# EAGLE design Daughter Card v2 (EAGLE 6.5.0)
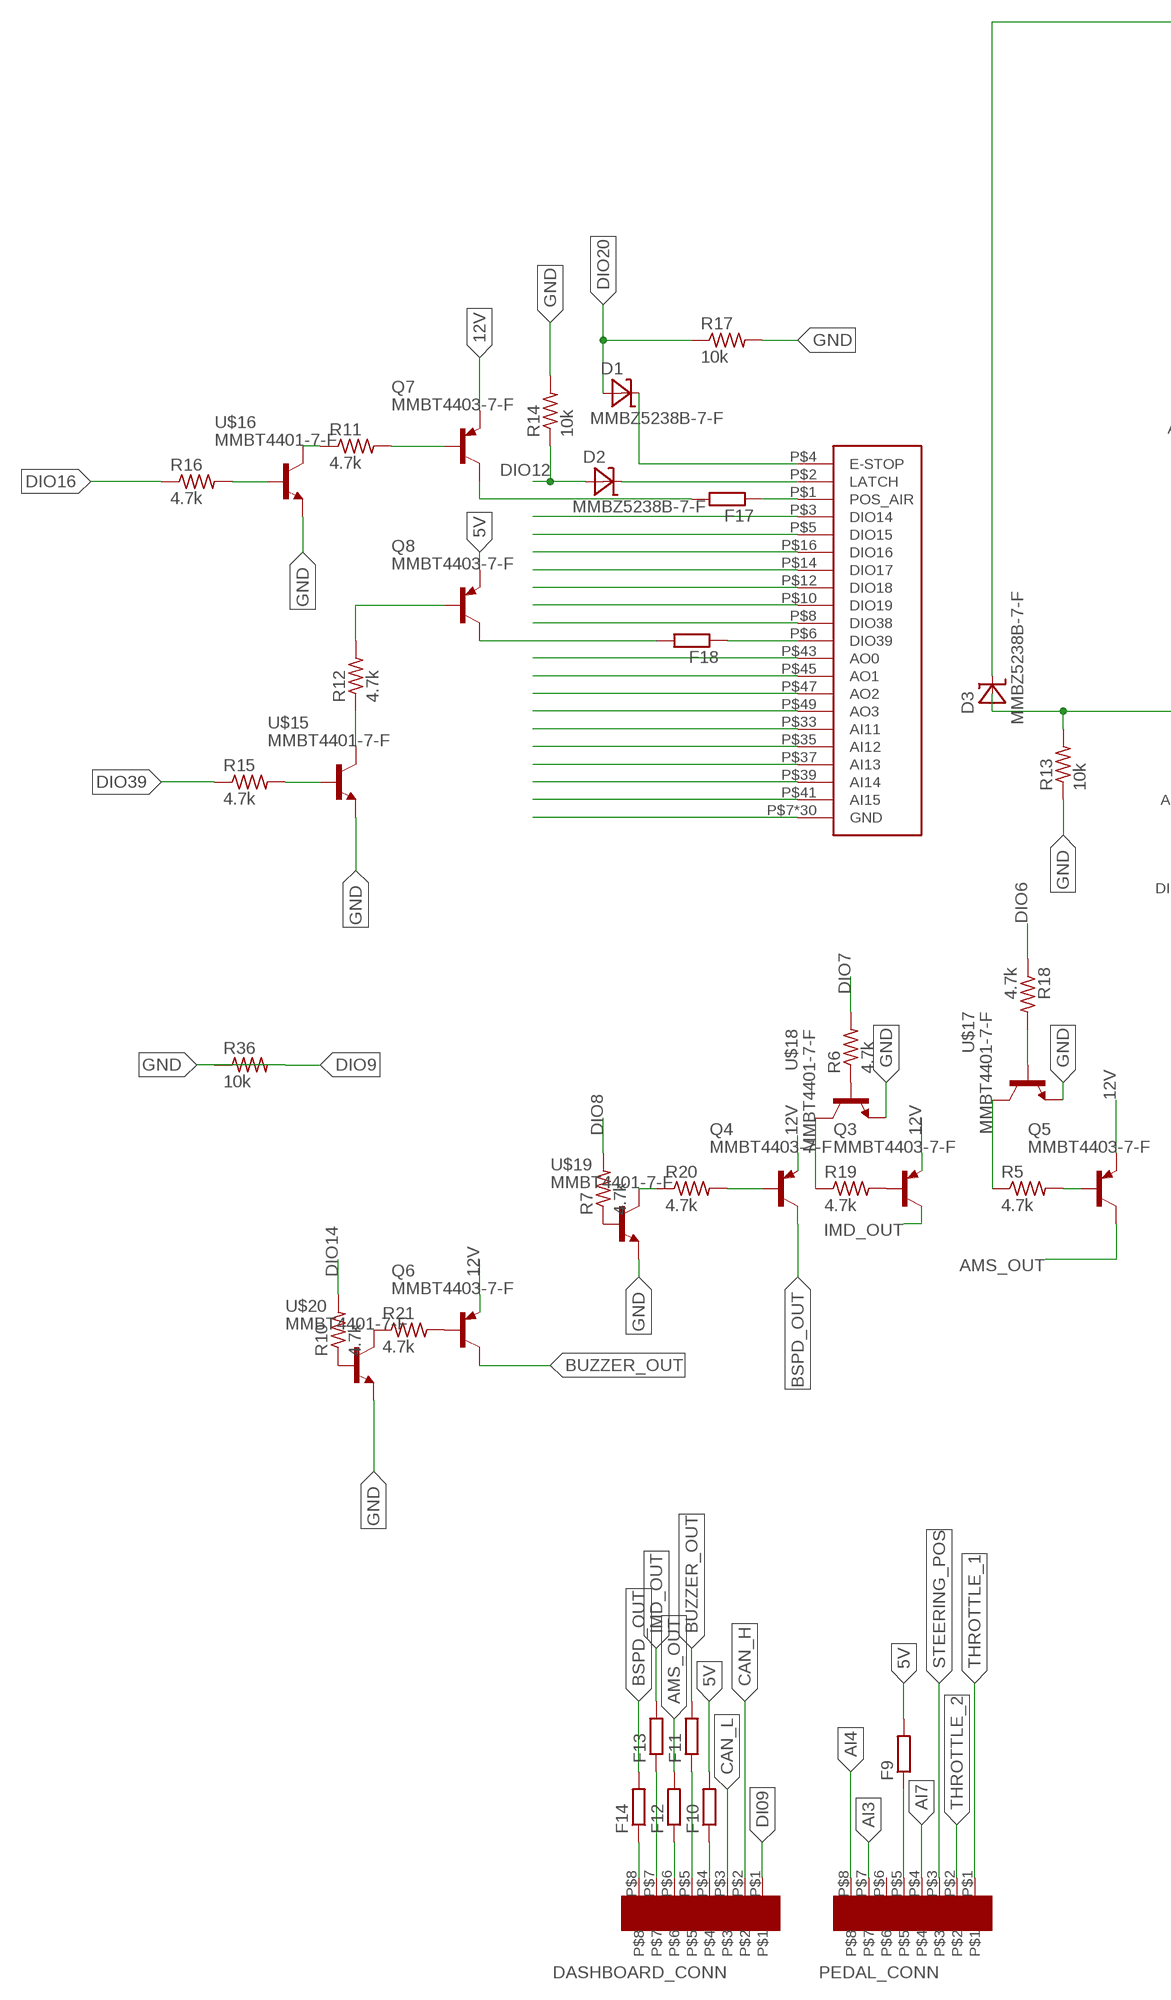
[diagram p0: schematic, sheet 1, part 1 of 2]
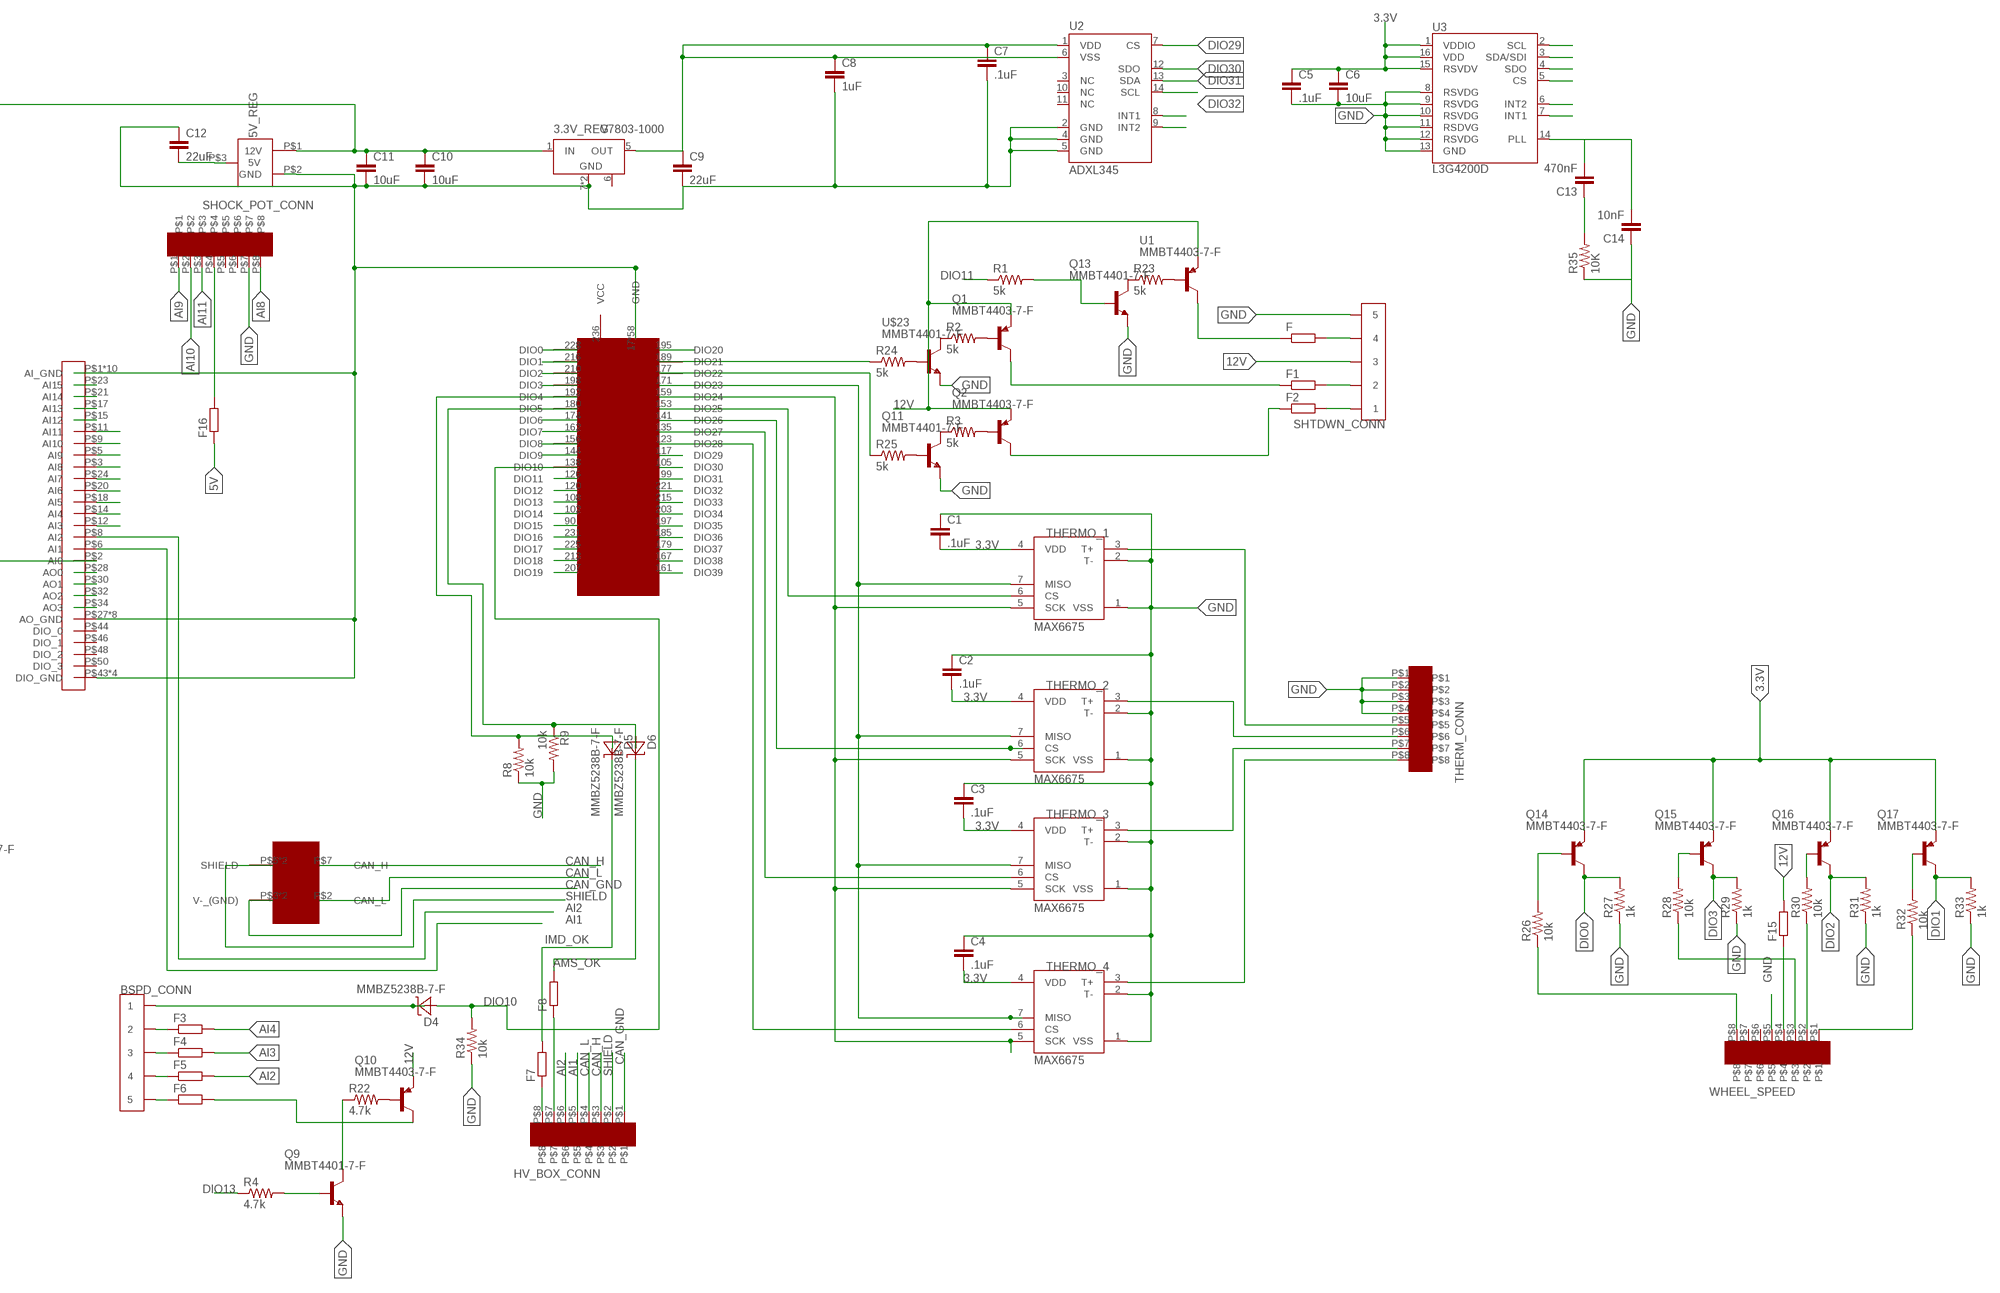
[diagram p1: schematic, sheet 1, part 2 of 2]

## Parts
3.3V_REG  V7803-1000  [V78XX-1000]
5V_REG  V78XX-1500  [V78XX-1500R]
BSPD_CONN  CONN_5  [CONNECTOR_5]
C1  .1uF  CAP0603-CAP  [0603-CAP]
C2  .1uF  CAP0603-CAP  [0603-CAP]
C3  .1uF  CAP0603-CAP  [0603-CAP]
C4  .1uF  CAP0603-CAP  [0603-CAP]
C5  .1uF  CAP0603-CAP  [0603-CAP]
C6  10uF  CAP0603-CAP  [0603-CAP]
C7  .1uF  CAP0603-CAP  [0603-CAP]
C8  1uF  CAP0603-CAP  [0603-CAP]
C9  22uF  CAP0603-CAP  [0603-CAP]
C10  10uF  CAP0603-CAP  [0603-CAP]
C11  10uF  CAP0603-CAP  [0603-CAP]
C12  22uF  CAP0603-CAP  [0603-CAP]
C13  470nF  CAP0603-CAP  [0603-CAP]
C14  10nF  CAP0603-CAP  [0603-CAP]
D1  MMBZ5238B-7-F  [SOT-23-3]
D2  MMBZ5238B-7-F  [SOT-23-3]
D3  MMBZ5238B-7-F  [SOT-23-3]
D4  MMBZ5238B-7-F  [SOT-23-3]
D5  MMBZ5238B-7-F  [SOT-23-3]
D6  MMBZ5238B-7-F  [SOT-23-3]
DASHBOARD_CONN  EN3_PCB_8  [EN3_PCB_8]
F  R-EU_R0402  [R0402]
F1  R-EU_R0402  [R0402]
F2  R-EU_R0402  [R0402]
F3  R-EU_R0402  [R0402]
F4  R-EU_R0402  [R0402]
F5  R-EU_R0402  [R0402]
F6  R-EU_R0402  [R0402]
F7  R-EU_R0402  [R0402]
F8  R-EU_R0402  [R0402]
F9  R-EU_R0402  [R0402]
F10  R-EU_R0402  [R0402]
F11  R-EU_R0402  [R0402]
F12  R-EU_R0402  [R0402]
F13  R-EU_R0402  [R0402]
F14  R-EU_R0402  [R0402]
F15  R-EU_R0402  [R0402]
F16  R-EU_R0402  [R0402]
F17  R-EU_R0402  [R0402]
F18  R-EU_R0402  [R0402]
HV_BOX_CONN  EN3_PCB_8  [EN3_PCB_8]
PEDAL_CONN  EN3_PCB_8  [EN3_PCB_8]
Q1  MMBT4403-7-F  [SOT-23-3]
Q2  MMBT4403-7-F  [SOT-23-3]
Q3  MMBT4403-7-F  [SOT-23-3]
Q4  MMBT4403-7-F  [SOT-23-3]
Q5  MMBT4403-7-F  [SOT-23-3]
Q6  MMBT4403-7-F  [SOT-23-3]
Q7  MMBT4403-7-F  [SOT-23-3]
Q8  MMBT4403-7-F  [SOT-23-3]
Q9  MMBT4401-7-F  [SOT-23-3]
Q10  MMBT4403-7-F  [SOT-23-3]
Q11  MMBT4401-7-F  [SOT-23-3]
Q13  MMBT4401-7-F  [SOT-23-3]
Q14  MMBT4403-7-F  [SOT-23-3]
Q15  MMBT4403-7-F  [SOT-23-3]
Q16  MMBT4403-7-F  [SOT-23-3]
Q17  MMBT4403-7-F  [SOT-23-3]
R1  5k  R-US_R0402  [R0402]
R2  5k  R-US_R0402  [R0402]
R3  5k  R-US_R0402  [R0402]
R4  4.7k  R-US_R0402  [R0402]
R5  4.7k  R-US_R0402  [R0402]
R6  4.7k  R-US_R0402  [R0402]
R7  4.7k  R-US_R0402  [R0402]
R8  10k  R-US_R0402  [R0402]
R9  10k  R-US_R0402  [R0402]
R10  4.7k  R-US_R0402  [R0402]
R11  4.7k  R-US_R0402  [R0402]
R12  4.7k  R-US_R0402  [R0402]
R13  10k  R-US_R0402  [R0402]
R14  10k  R-US_R0402  [R0402]
R15  4.7k  R-US_R0402  [R0402]
R16  4.7k  R-US_R0402  [R0402]
R17  10k  R-US_R0402  [R0402]
R18  4.7k  R-US_R0402  [R0402]
R19  4.7k  R-US_R0402  [R0402]
R20  4.7k  R-US_R0402  [R0402]
R21  4.7k  R-US_R0402  [R0402]
R22  4.7k  R-US_R0402  [R0402]
R23  5k  R-US_R0402  [R0402]
R24  5k  R-US_R0402  [R0402]
R25  5k  R-US_R0402  [R0402]
R26  10k  R-US_R0402  [R0402]
R27  1k  R-US_R0402  [R0402]
R28  10k  R-US_R0402  [R0402]
R29  1k  R-US_R0402  [R0402]
R30  10k  R-US_R0402  [R0402]
R31  1k  R-US_R0402  [R0402]
R32  10k  R-US_R0402  [R0402]
R33  1k  R-US_R0402  [R0402]
R34  10k  R-US_R0402  [R0402]
R35  10K  RESISTOR0603-RES  [0603-RES]
R36  10k  R-US_R0402  [R0402]
SBRIO_ANALOG  SBRIO_MIO  [SBRIO_J502_J503]
SBRIO_AUX  SBRIO_AUX  [SBRIO_J502_J503]
SHOCK_POT_CONN  EN3_PCB_8  [EN3_PCB_8]
SHTDWN_CONN  CONN_5  [CONNECTOR_5]
THERM_CONN  EN3_PCB_8  [EN3_PCB_8]
THERMO_1  MAX6675  [SO08]
THERMO_2  MAX6675  [SO08]
THERMO_3  MAX6675  [SO08]
THERMO_4  MAX6675  [SO08]
U1  MMBT4403-7-F  [SOT-23-3]
U2  ADXL345  [LGA14]
U3  L3G4200D  [LGA16-4X4]
U$2  SBRIO_W500  [SBRIO_W]
U$3  SBRIO_RMC  [SEAM-40-XX.X-XX-06-X-A]
U$15  MMBT4401-7-F  [SOT-23-3]
U$16  MMBT4401-7-F  [SOT-23-3]
U$17  MMBT4401-7-F  [SOT-23-3]
U$18  MMBT4401-7-F  [SOT-23-3]
U$19  MMBT4401-7-F  [SOT-23-3]
U$20  MMBT4401-7-F  [SOT-23-3]
U$23  MMBT4401-7-F  [SOT-23-3]
WHEEL_SPEED  EN3_PCB_8  [EN3_PCB_8]

## Nets
3.3V: 3.3V_REG.5(OUT) C1.2 C2.2 C3.2 C4.2 C5.1 C6.1 C7.1 C8.1 C9.1 Q14.P$3(E) Q15.P$3(E) Q16.P$3(E) Q17.P$3(E) THERMO_1.4(VDD) THERMO_2.4(VDD) THERMO_3.4(VDD) THERMO_4.4(VDD) U2.1(VDD) U2.6(VSS) U3.1(VDDIO) U3.15(RSVDV) U3.16(VDD)
5V: 5V_REG.P$3(5V) C12.2 F9.2 F10.2 F16.1 Q8.P$3(E)
12V: 3.3V_REG.1(IN) 5V_REG.P$1(12V) C10.1 C11.1 D3.P$1(C) F15.2 Q1.P$3(E) Q2.P$3(E) Q3.P$3(E) Q4.P$3(E) Q5.P$3(E) Q6.P$3(E) Q7.P$3(E) Q10.P$3(E) SHTDWN_CONN.5 SHTDWN_CONN.6 U1.P$3(E)
AI1: HV_BOX_CONN.P$5 SBRIO_ANALOG.P$6(AI1)
AI2: F5.2 HV_BOX_CONN.P$6 SBRIO_ANALOG.P$8(AI2)
AI3: F4.2 PEDAL_CONN.P$7 SBRIO_ANALOG.P$12(AI3)
AI4: F3.2 PEDAL_CONN.P$8 SBRIO_ANALOG.P$14(AI4)
AI7: PEDAL_CONN.P$4 SBRIO_ANALOG.P$24(AI7)
AI8: SBRIO_ANALOG.P$3(AI8) SHOCK_POT_CONN.P$8
AI9: SBRIO_ANALOG.P$5(AI9) SHOCK_POT_CONN.P$1
AI10: SBRIO_ANALOG.P$9(AI10) SHOCK_POT_CONN.P$2
AI11: SBRIO_ANALOG.P$11(AI11) SBRIO_AUX.P$33(AI11) SHOCK_POT_CONN.P$3
AI12: SBRIO_ANALOG.P$15(AI12) SBRIO_AUX.P$35(AI12)
AI13: SBRIO_ANALOG.P$17(AI13) SBRIO_AUX.P$37(AI13)
AI15: SBRIO_ANALOG.P$23(AI15) SBRIO_AUX.P$41(AI15)
AMS_OK: D6.P$1(C) F8.2
AMS_OUT: F12.2 Q5.P$1(C)
AO0: SBRIO_ANALOG.P$28(AO0) SBRIO_AUX.P$43(AO0)
AO1: SBRIO_ANALOG.P$30(AO1) SBRIO_AUX.P$45(AO1)
AO2: SBRIO_ANALOG.P$32(AO2) SBRIO_AUX.P$47(AO2)
AO3: SBRIO_ANALOG.P$34(AO3) SBRIO_AUX.P$49(AO3)
BSPD_OUT: F14.2 Q4.P$1(C)
BUZZER_OUT: F11.2 Q6.P$1(C)
CAN_GND: HV_BOX_CONN.P$1 U$2.P$3(V-_(GND)) U$2.P$6(V-_(GND))
CAN_H: DASHBOARD_CONN.P$2 HV_BOX_CONN.P$3 U$2.P$7(CAN_H)
CAN_L: DASHBOARD_CONN.P$3 HV_BOX_CONN.P$4 U$2.P$2(CAN_L)
DI09: DASHBOARD_CONN.P$1
DIO0: Q14.P$1(C) R27.2 U$3.228(DIO0)
DIO1: Q17.P$1(C) R33.2 U$3.216(DIO1)
DIO2: Q16.P$1(C) R31.2 U$3.210(DIO2)
DIO3: Q15.P$1(C) R29.2 U$3.198(DIO3)
DIO6: R18.1 U$3.174(DIO6)
DIO7: R6.2 U$3.162(DIO7)
DIO8: R7.2 U$3.156(DIO8)
DIO9: R36.2 U$3.144(DIO9)
DIO10: D4.P$2(A) R34.2 U$3.138(DIO10)
DIO11: R1.1 U$3.126(DIO11)
DIO12: D2.P$2(A) R14.1 U$3.120(DIO12)
DIO13: R4.1 U$3.108(DIO13)
DIO14: R10.2 SBRIO_AUX.P$3(DIO14) U$3.102(DIO14)
DIO15: SBRIO_AUX.P$5(DIO15) U$3.90(DIO15)
DIO16: R16.1 SBRIO_AUX.P$16(DIO16) U$3.231(DIO16)
DIO17: SBRIO_AUX.P$14(DIO17) U$3.225(DIO17)
DIO18: SBRIO_AUX.P$12(DIO18) U$3.213(DIO18)
DIO19: SBRIO_AUX.P$10(DIO19) U$3.207(DIO19)
DIO20: D1.P$2(A) R17.1 U$3.195(DIO20)
DIO29: U2.7(CS) U$3.117(DIO29)
DIO30: U2.12(SDO) U3.4(SDO) U$3.105(DIO30)
DIO31: U2.13(SDA) U3.3(SDA/SDI) U$3.99(DIO31)
DIO32: U2.14(SCL) U3.2(SCL) U$3.221(DIO32)
DIO33: U3.5(CS) U$3.215(DIO33)
DIO34: U3.7(INT1) U$3.203(DIO34)
DIO35: U3.6(INT2) U$3.197(DIO35)
DIO36: U2.8(INT1) U$3.185(DIO36)
DIO37: U2.9(INT2) U$3.179(DIO37)
DIO38: SBRIO_AUX.P$8(DIO38) U$3.167(DIO38)
DIO39: R15.1 U$3.161(DIO39)
GND: 3.3V_REG.7(GND) 3.3V_REG.9(GND) 5V_REG.P$2(GND) C1.1 C2.1 C3.1 C4.1 C5.2 C6.2 C7.2 C8.2 C9.2 C10.2 C11.2 C12.1 C14.1 Q9.P$3(E) Q11.P$3(E) Q13.P$3(E) R8.1 R9.2 R13.1 R14.2 R17.2 R27.1 R29.1 R31.1 R33.1 R34.1 R35.1 R36.1 SBRIO_ANALOG.P$1(AI_GND) SBRIO_ANALOG.P$4(AI_GND) SBRIO_ANALOG.P$7(AI_GND) SBRIO_ANALOG.P$10(AI_GND) SBRIO_ANALOG.P$13(AI_GND) SBRIO_ANALOG.P$16(AI_GND) SBRIO_ANALOG.P$19(AI_GND) SBRIO_ANALOG.P$22(AI_GND) SBRIO_ANALOG.P$25(AI_GND) SBRIO_ANALOG.P$26(AI_GND) SBRIO_ANALOG.P$27(AO_GND) SBRIO_ANALOG.P$29(AO_GND) SBRIO_ANALOG.P$31(AO_GND) SBRIO_ANALOG.P$33(AO_GND) SBRIO_ANALOG.P$35(AO_GND) SBRIO_ANALOG.P$37(AO_GND) SBRIO_ANALOG.P$39(AO_GND) SBRIO_ANALOG.P$41(AO_GND) SBRIO_ANALOG.P$43(DIO_GND) SBRIO_ANALOG.P$45(DIO_GND) SBRIO_ANALOG.P$47(DIO_GND) SBRIO_ANALOG.P$49(DIO_GND) SBRIO_AUX.P$7(GND) SBRIO_AUX.P$9(GND) SBRIO_AUX.P$11(GND) SBRIO_AUX.P$13(GND) SBRIO_AUX.P$15(GND) SBRIO_AUX.P$17(GND) SBRIO_AUX.P$18(GND) SBRIO_AUX.P$19(GND) SBRIO_AUX.P$20(GND) SBRIO_AUX.P$21(GND) SBRIO_AUX.P$22(GND) SBRIO_AUX.P$23(GND) SBRIO_AUX.P$24(GND) SBRIO_AUX.P$25(GND) SBRIO_AUX.P$26(GND) SBRIO_AUX.P$27(GND) SBRIO_AUX.P$28(GND) SBRIO_AUX.P$29(GND) SBRIO_AUX.P$30(GND) SBRIO_AUX.P$31(GND) SBRIO_AUX.P$32(GND) SBRIO_AUX.P$34(GND) SBRIO_AUX.P$36(GND) SBRIO_AUX.P$38(GND) SBRIO_AUX.P$40(GND) SBRIO_AUX.P$42(GND) SBRIO_AUX.P$44(GND) SBRIO_AUX.P$46(GND) SBRIO_AUX.P$48(GND) SBRIO_AUX.P$50(GND) SHOCK_POT_CONN.P$7 SHTDWN_CONN.9 SHTDWN_CONN.10 THERM_CONN.P$1 THERM_CONN.P$2 THERM_CONN.P$3 THERM_CONN.P$4 THERMO_1.1(VSS) THERMO_1.2(T-) THERMO_2.1(VSS) THERMO_2.2(T-) THERMO_3.1(VSS) THERMO_3.2(T-) THERMO_4.1(VSS) THERMO_4.2(T-) U2.2(GND) U2.4(GND) U2.5(GND) U3.8(RSVDG) U3.9(RSVDG) U3.10(RSVDG) U3.11(RSDVG) U3.12(RSVDG) U3.13(GND) U$3.17(GND) U$3.23(GND) U$3.30(GND) U$3.36(GND) U$3.41(GND) U$3.47(GND) U$3.78(GND) U$3.83(GND) U$3.88(GND) U$3.93(GND) U$3.96(GND) U$3.98(GND) U$3.101(GND) U$3.103(GND) U$3.106(GND) U$3.111(GND) U$3.114(GND) U$3.116(GND) U$3.119(GND) U$3.121(GND) U$3.124(GND) U$3.129(GND) U$3.132(GND) U$3.134(GND) U$3.137(GND) U$3.139(GND) U$3.142(GND) U$3.147(GND) U$3.150(GND) U$3.152(GND) U$3.155(GND) U$3.157(GND) U$3.160(GND) U$3.165(GND) U$3.168(GND) U$3.170(GND) U$3.173(GND) U$3.175(GND) U$3.178(GND) U$3.183(GND) U$3.186(GND) U$3.188(GND) U$3.191(GND) U$3.193(GND) U$3.196(GND) U$3.201(GND) U$3.204(GND) U$3.206(GND) U$3.209(GND) U$3.211(GND) U$3.214(GND) U$3.219(GND) U$3.222(GND) U$3.224(GND) U$3.227(GND) U$3.229(GND) U$3.232(GND) U$3.237(GND) U$15.P$3(E) U$16.P$3(E) U$17.P$3(E) U$18.P$3(E) U$19.P$3(E) U$20.P$3(E) U$23.P$3(E) WHEEL_SPEED.P$5
IMD_OK: D5.P$1(C) F7.2
IMD_OUT: F13.2 Q3.P$1(C)
N$1: D2.P$1(C) SBRIO_AUX.P$2(LATCH)
N$2: D1.P$1(C) SBRIO_AUX.P$4(E-STOP)
N$3: R32.1 WHEEL_SPEED.P$1
N$4: D3.P$2(A) R13.2 SBRIO_ANALOG.P$2(AI0)
N$5: Q6.P$2(B) R21.2
N$6: Q16.P$2(B) R30.2
N$7: F1.1 Q1.P$1(C)
N$8: F2.1 Q2.P$1(C)
N$9: R28.1 WHEEL_SPEED.P$3
N$10: R26.1 WHEEL_SPEED.P$8
N$11: R24.1 U$3.189(DIO21)
N$12: R25.1 U$3.177(DIO22)
N$13: F8.1 HV_BOX_CONN.P$7
N$14: F7.1 HV_BOX_CONN.P$8
N$15: D5.P$2(A) R8.2 U$3.192(DIO4)
N$16: D6.P$2(A) R9.1 U$3.180(DIO5)
N$17: THERMO_1.7(MISO) THERMO_2.7(MISO) THERMO_3.7(MISO) THERMO_4.7(MISO) U$3.171(DIO23)
N$18: THERMO_1.5(SCK) THERMO_2.5(SCK) THERMO_3.5(SCK) THERMO_4.5(SCK) U$3.159(DIO24)
N$20: F16.2 SHOCK_POT_CONN.P$4
N$21: F15.1 WHEEL_SPEED.P$4
N$22: F9.1 PEDAL_CONN.P$5
N$23: DASHBOARD_CONN.P$4 F10.1
N$24: DASHBOARD_CONN.P$5 F11.1
N$25: THERMO_1.6(CS) U$3.153(DIO25)
N$26: THERMO_2.6(CS) U$3.141(DIO26)
N$27: THERMO_3.6(CS) U$3.135(DIO27)
N$28: THERMO_4.6(CS) U$3.123(DIO28)
N$29: THERM_CONN.P$5 THERMO_1.3(T+)
N$30: THERM_CONN.P$6 THERMO_2.3(T+)
N$31: THERM_CONN.P$7 THERMO_3.3(T+)
N$32: THERM_CONN.P$8 THERMO_4.3(T+)
N$33: DASHBOARD_CONN.P$6 F12.1
N$34: DASHBOARD_CONN.P$7 F13.1
N$35: DASHBOARD_CONN.P$8 F14.1
N$36: F.2 SHTDWN_CONN.7 SHTDWN_CONN.8
N$37: C13.2 C14.2 U3.14(PLL)
N$38: C13.1 R35.2
N$39: F1.2 SHTDWN_CONN.3 SHTDWN_CONN.4
N$40: F2.2 SHTDWN_CONN.1 SHTDWN_CONN.2
N$41: BSPD_CONN.9 BSPD_CONN.10 F6.1
N$42: BSPD_CONN.1 BSPD_CONN.2 D4.P$1(C)
N$43: BSPD_CONN.7 BSPD_CONN.8 F5.1
N$44: F.1 U1.P$1(C)
N$45: F6.2 Q10.P$1(C)
N$46: R23.2 U1.P$2(B)
N$47: Q1.P$2(B) R2.2
N$48: Q2.P$2(B) R3.2
N$49: Q10.P$2(B) R22.2
N$50: Q5.P$2(B) R5.2
N$51: Q3.P$2(B) R19.2
N$52: BSPD_CONN.5 BSPD_CONN.6 F4.1
N$53: BSPD_CONN.3 BSPD_CONN.4 F3.1
N$54: Q7.P$2(B) R11.2
N$55: F17.1 SBRIO_AUX.P$1(POS_AIR)
N$56: F17.2 Q7.P$1(C)
N$57: F18.2 Q8.P$1(C)
N$58: Q8.P$2(B) R12.2
N$59: F18.1 SBRIO_AUX.P$6(DIO39)
N$60: R15.2 U$15.P$2(B)
N$61: R12.1 U$15.P$1(C)
N$62: R16.2 U$16.P$2(B)
N$63: R11.1 U$16.P$1(C)
N$64: R5.1 U$17.P$1(C)
N$65: R18.2 U$17.P$2(B)
N$66: R19.1 U$18.P$1(C)
N$67: R6.1 U$18.P$2(B)
N$68: Q4.P$2(B) R20.2
N$69: R20.1 U$19.P$1(C)
N$70: R7.1 U$19.P$2(B)
N$71: R21.1 U$20.P$1(C)
N$72: R10.1 U$20.P$2(B)
N$73: Q9.P$1(C) R22.1
N$74: Q9.P$2(B) R4.2
N$75: Q13.P$1(C) R23.1
N$76: Q13.P$2(B) R1.2
N$77: R2.1 U$23.P$1(C)
N$78: Q11.P$1(C) R3.1
N$79: R24.2 U$23.P$2(B)
N$80: Q11.P$2(B) R25.2
N$81: Q14.P$2(B) R26.2
N$82: Q15.P$2(B) R28.2
N$83: R30.1 WHEEL_SPEED.P$2
N$84: Q17.P$2(B) R32.2
SHIELD: HV_BOX_CONN.P$2 U$2.P$5(SHIELD) U$2.P$10(SHIELD)
STEERING_POS: PEDAL_CONN.P$3 SBRIO_ANALOG.P$21(AI14) SBRIO_AUX.P$39(AI14)
THROTTLE_1: PEDAL_CONN.P$1 SBRIO_ANALOG.P$18(AI5)
THROTTLE_2: PEDAL_CONN.P$2 SBRIO_ANALOG.P$20(AI6)
Unconnected: 3.3V_REG.6 PEDAL_CONN.P$6 SBRIO_ANALOG.P$44(DIO_0) SBRIO_ANALOG.P$46(DIO_1) SBRIO_ANALOG.P$48(DIO_2) SBRIO_ANALOG.P$50(DIO_3) SHOCK_POT_CONN.P$5 SHOCK_POT_CONN.P$6 U2.3(NC) U2.10(NC) U2.11(NC) WHEEL_SPEED.P$6 WHEEL_SPEED.P$7

## Power pins joined to a net without a drawn wire
VCC: U$3.236(VCC)

## Library data of the parts
3.3V_REG = formula electric:V7803-1000
5V_REG = formula electric:V78XX-1500
BSPD_CONN SHTDWN_CONN = formula electric:CONN_5
C1-C14 = SparkFun-Passives:CAP: Capacitor Standard 0603 ceramic capacitor, and 0.1" leaded capacitor.
D1-D6 = formula electric:MMBZ5238B-7-F: Digikey: MMBZ5238B-FDICT-ND
DASHBOARD_CONN HV_BOX_CONN PEDAL_CONN SHOCK_POT_CONN THERM_CONN WHEEL_SPEED = formula electric:EN3_PCB_8
F F1-F18 = resistor:R-EU_: RESISTOR, European symbol
Q1-Q8 Q10 Q14-Q17 U1 = formula electric:MMBT4403-7-F
Q9 Q11 Q13 U$15-U$20 U$23 = formula electric:MMBT4401-7-F
R1-R34 R36 = resistor:R-US_: RESISTOR, American symbol
R35 = SparkFun-Passives:RESISTOR: Resistor Basic schematic elements and footprints for 0603, 1206, and PTH resistors.
SBRIO_ANALOG = formula electric:SBRIO_MIO
SBRIO_AUX = formula electric:SBRIO_AUX: An output for a lot of the extra pins on the sbRIO.
THERMO_1-THERMO_4 = max6675:MAX6675
U2 = SparkFun-Sensors:ADXL345: 3-axis SPI/I2C 2/4/8/16g accelerometer
U3 = SparkFun-Sensors:L3G4200D: L3G4200D Three-axis, digital output gyroscope The L3G4200D is a low-power three-axis angular rate sensor, has a full scale of ±250/±500/±2000 dps and is capable of measuring rates with a user-selectable bandwidth. It includes a sensing element and an IC interface capable of providing the measured angular rate to the external world through a digital interface (I2C/SPI). Package: 4x4x1.1 LGA-16 (LGA16-4x4.PAC)
U$2 = formula electric:SBRIO_W500
U$3 = SEAM-40-XX.X-XX-06-X-A:SBRIO_RMC

## Net classes
0 default: clearance 0.205 mm

## Board
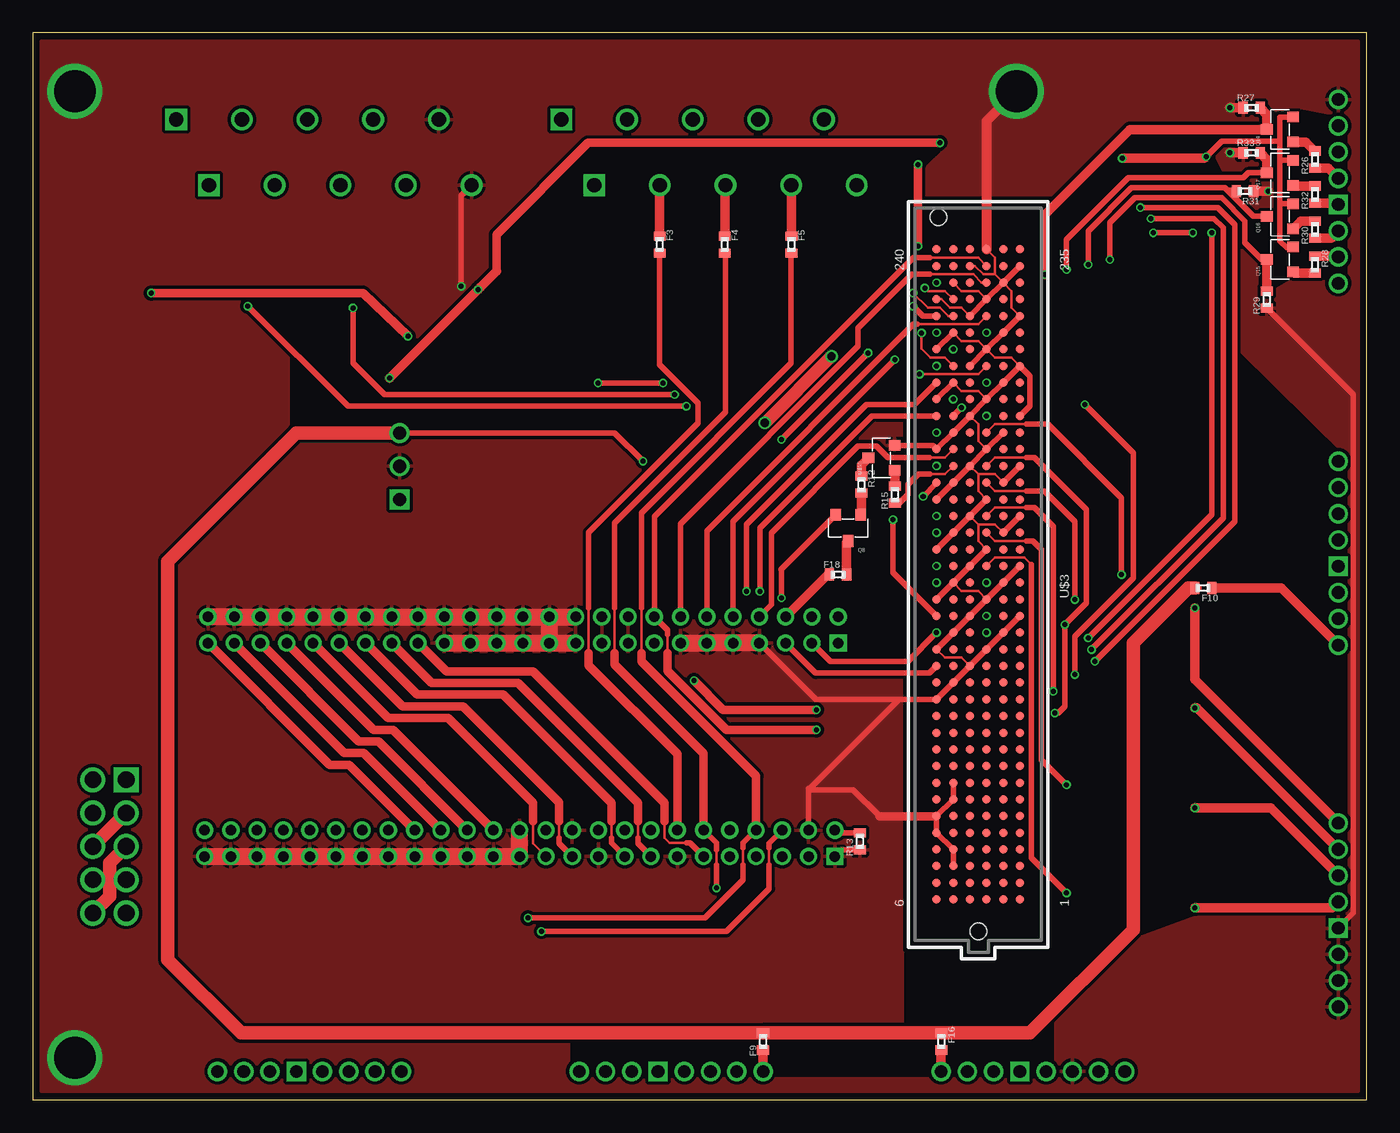
[diagram p2: board, top side]
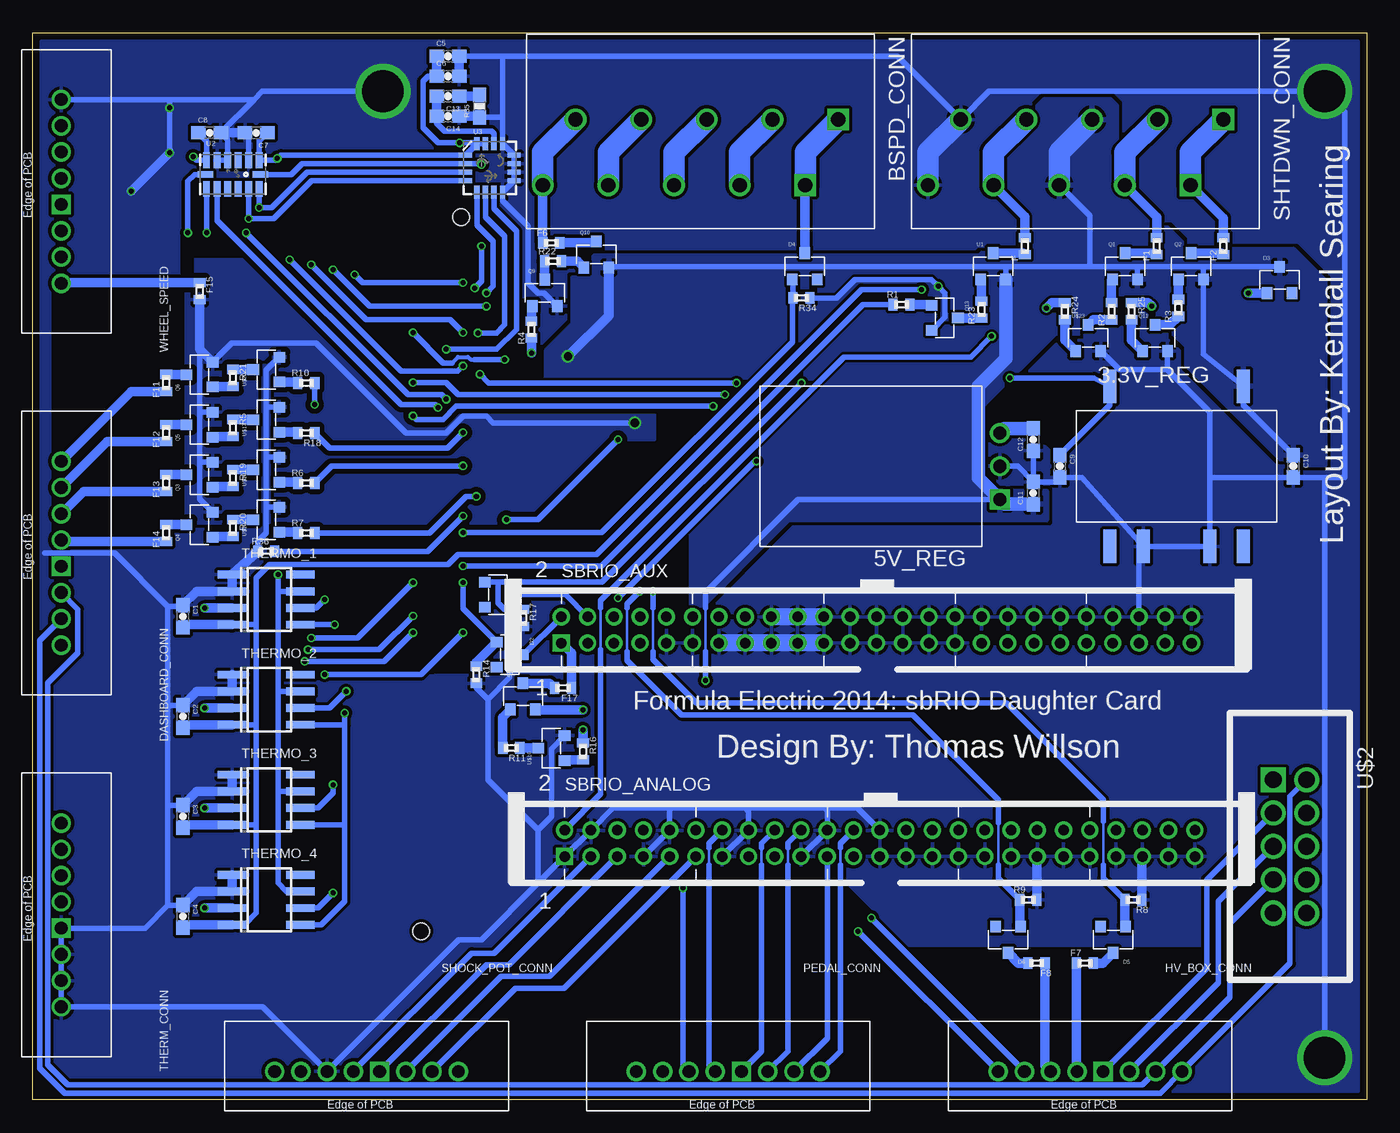
[diagram p3: board, bottom side, seen from below]

Size 101.6 x 81.28 mm. Coordinates in mm from the lower left corner, seen from the top.
Outline: 0,0 101.6,0 101.6,81.28 0,81.28 0,0
Copper layers (1*16): Top 0.035mm / dielectric 1.5mm / Bottom 0.035mm
Design rules "PCBFabExpress DRC *": minimum track width 6mil, minimum drill 15mil, track to track 6mil, track to pad 8mil, pad to pad 8mil, via to via 8mil, smd to smd 8mil, copper to edge 10mil, drill to drill 8mil, minimum pad ring 10mil, minimum via ring 5mil, stop-mask expansion 2mil, vias tented up to drill 15mil, thermal gap 10mil
tRestrict: area 66.5,11.4 to 77.5,68.6; area 46.7,33.9 to 48,35.9; area 51.9,19.6 to 54.2,21.3; area 54.5,17 to 55.8,19.4; area 46.5,19.6 to 47.8,21.2; 17 lines
bRestrict: area 54.7,34.2 to 55.9,35.6; 9 lines

### Footprints (pad centres in the part's own frame; a part is rotated, then mirrored left to right if it is on the bottom)
V78XX-1000 = smd 1 x 2.54: 1 -5.08,-6.096; 5 5.08,-6.096; 6 5.08,6.096; 7 2.54,6.096; 9 -2.54,6.096; 10 -5.08,6.096
V78XX-1500R = drill 1 square: P$1 0,2.54 | drill 1: P$2 0,0; P$3 0,-2.54
CONNECTOR_5 = drill 1.1 square: 1 0,0; 2 2.5,5 | drill 1.1: 3 5,0; 4 7.5,5; 5 10,0; 6 12.5,5; 7 15,0; 8 17.5,5; 9 20,0; 10 22.5,5
0603-CAP = smd 1.1 x 1: 1 -0.85,0; 2 0.85,0
SOT-23-3 = smd 0.8 x 0.9: P$1 0,1; P$2 -0.95,-1; P$3 0.95,-1
EN3_PCB_8 = drill 0.965 pad 1.397 square: P$1 0,0 | drill 0.965 pad 1.397: P$2 2,0; P$3 4,0; P$4 6,0; P$5 -8,0; P$6 -6,0; P$7 -4,0; P$8 -2,0
R0402 = smd 0.7 x 0.9: 1 -0.65,0; 2 0.65,0
0603-RES = smd 1.1 x 1: 1 -0.85,0; 2 0.85,0
SBRIO_J502_J503 = drill 0.8 square: P$1 0,0 | drill 0.8: P$2 0,2; P$3 2,0; P$4 2,2; P$5 4,0; P$6 4,2; P$7 6,0; P$8 6,2; P$9 8,0; P$10 8,2; P$11 10,0; P$12 10,2; P$13 12,0; P$14 12,2; P$15 14,0; P$16 14,2; P$17 16,0; P$18 16,2; P$19 18,0; P$20 18,2; P$21 20,0; P$22 20,2; P$23 22,0; P$24 22,2; P$25 24,0; P$26 24,2; P$27 26,0; P$28 26,2; P$29 28,0; P$30 28,2; P$31 30,0; P$32 30,2; P$33 32,0; P$34 32,2; P$35 34,0; P$36 34,2; P$37 36,0; P$38 36,2; P$39 38,0; P$40 38,2; P$41 40,0; P$42 40,2; P$43 42,0; P$44 42,2; P$45 44,0; P$46 44,2; P$47 46,0; P$48 46,2; P$49 48,0; P$50 48,2
SO08 = smd 0.6 x 2.2: 1 -1.905,-2.6; 2 -0.635,-2.6; 3 0.635,-2.6; 4 1.905,-2.6; 5 1.905,2.6; 6 0.635,2.6; 7 -0.635,2.6; 8 -1.905,2.6
LGA14 = smd 0.5 x 1.2: 1 2,1.1; 2 1.2,1.1; 3 0.4,1.1; 4 -0.4,1.1; 5 -1.2,1.1; 6 -2,1.1; 8 -2,-1.1; 9 -1.2,-1.1; 10 -0.4,-1.1; 11 0.4,-1.1; 12 1.2,-1.1; 13 2,-1.1 | smd 1.2 x 0.5: 7 -2.1,0; 14 2.1,0
LGA16-4X4 = smd 1 x 0.4: 1 -1.85,0.975; 2 -1.85,0.325; 3 -1.85,-0.325; 4 -1.85,-0.975; 9 1.85,-0.975; 10 1.85,-0.325; 11 1.85,0.325; 12 1.85,0.975 | smd 0.4 x 1: 5 -0.975,-1.85; 6 -0.325,-1.85; 7 0.325,-1.85; 8 0.975,-1.85; 13 0.975,1.85; 14 0.325,1.85; 15 -0.325,1.85; 16 -0.975,1.85
SBRIO_W = drill 1.27 pad 1.778 square: P$1 -5.08,-1.27 | drill 1.27 pad 1.778: P$2 -5.08,1.27; P$3 -2.54,-1.27; P$4 -2.54,1.27; P$5 0,-1.27; P$6 0,1.27; P$7 2.54,-1.27; P$8 2.54,1.27; P$9 5.08,-1.27; P$10 5.08,1.27
SEAM-40-XX.X-XX-06-X-A = smd 0.635 x 0.635: 1 24.765,3.175; 2 24.765,1.905; 3 24.765,0.635; 4 24.765,-0.635; 5 24.765,-1.905; 6 24.765,-3.175; 7 23.495,3.175; 8 23.495,1.905; 9 23.495,0.635; 10 23.495,-0.635; 11 23.495,-1.905; 12 23.495,-3.175; 13 22.225,3.175; 14 22.225,1.905; 15 22.225,0.635; 16 22.225,-0.635; 17 22.225,-1.905; 18 22.225,-3.175; 19 20.955,3.175; 20 20.955,1.905; 21 20.955,0.635; 22 20.955,-0.635; 23 20.955,-1.905; 24 20.955,-3.175; 25 19.685,3.175; 26 19.685,1.905; 27 19.685,0.635; 28 19.685,-0.635; 29 19.685,-1.905; 30 19.685,-3.175; 31 18.415,3.175; 32 18.415,1.905; 33 18.415,0.635; 34 18.415,-0.635; 35 18.415,-1.905; 36 18.415,-3.175; 37 17.145,3.175; 38 17.145,1.905; 39 17.145,0.635; 40 17.145,-0.635; 41 17.145,-1.905; 42 17.145,-3.175; 43 15.875,3.175; 44 15.875,1.905; 45 15.875,0.635; 46 15.875,-0.635; 47 15.875,-1.905; 48 15.875,-3.175; 49 14.605,3.175; 50 14.605,1.905; 51 14.605,0.635; 52 14.605,-0.635; 53 14.605,-1.905; 54 14.605,-3.175; 55 13.335,3.175; 56 13.335,1.905; 57 13.335,0.635; 58 13.335,-0.635; 59 13.335,-1.905; 60 13.335,-3.175; 61 12.065,3.175; 62 12.065,1.905; 63 12.065,0.635; 64 12.065,-0.635; 65 12.065,-1.905; 66 12.065,-3.175; 67 10.795,3.175; 68 10.795,1.905; 69 10.795,0.635; 70 10.795,-0.635; 71 10.795,-1.905; 72 10.795,-3.175; 73 9.525,3.175; 74 9.525,1.905; 75 9.525,0.635; 76 9.525,-0.635; 77 9.525,-1.905; 78 9.525,-3.175; 79 8.255,3.175; 80 8.255,1.905; 81 8.255,0.635; 82 8.255,-0.635; 83 8.255,-1.905; 84 8.255,-3.175; 85 6.985,3.175; 86 6.985,1.905; 87 6.985,0.635; 88 6.985,-0.635; 89 6.985,-1.905; 90 6.985,-3.175; 91 5.715,3.175; 92 5.715,1.905; 93 5.715,0.635; 94 5.715,-0.635; 95 5.715,-1.905; 96 5.715,-3.175; 97 4.445,3.175; 98 4.445,1.905; 99 4.445,0.635; 100 4.445,-0.635; 101 4.445,-1.905; 102 4.445,-3.175; 103 3.175,3.175; 104 3.175,1.905; 105 3.175,0.635; 106 3.175,-0.635; 107 3.175,-1.905; 108 3.175,-3.175; 109 1.905,3.175; 110 1.905,1.905; 111 1.905,0.635; 112 1.905,-0.635; 113 1.905,-1.905; 114 1.905,-3.175; 115 0.635,3.175; 116 0.635,1.905; 117 0.635,0.635; 118 0.635,-0.635; 119 0.635,-1.905; 120 0.635,-3.175; 121 -0.635,3.175; 122 -0.635,1.905; 123 -0.635,0.635; 124 -0.635,-0.635; 125 -0.635,-1.905; 126 -0.635,-3.175; 127 -1.905,3.175; 128 -1.905,1.905; 129 -1.905,0.635; 130 -1.905,-0.635; 131 -1.905,-1.905; 132 -1.905,-3.175; 133 -3.175,3.175; 134 -3.175,1.905; 135 -3.175,0.635; 136 -3.175,-0.635; 137 -3.175,-1.905; 138 -3.175,-3.175; 139 -4.445,3.175; 140 -4.445,1.905; 141 -4.445,0.635; 142 -4.445,-0.635; 143 -4.445,-1.905; 144 -4.445,-3.175; 145 -5.715,3.175; 146 -5.715,1.905; 147 -5.715,0.635; 148 -5.715,-0.635; 149 -5.715,-1.905; 150 -5.715,-3.175; 151 -6.985,3.175; 152 -6.985,1.905; 153 -6.985,0.635; 154 -6.985,-0.635; 155 -6.985,-1.905; 156 -6.985,-3.175; 157 -8.255,3.175; 158 -8.255,1.905; 159 -8.255,0.635; 160 -8.255,-0.635; 161 -8.255,-1.905; 162 -8.255,-3.175; 163 -9.525,3.175; 164 -9.525,1.905; 165 -9.525,0.635; 166 -9.525,-0.635; 167 -9.525,-1.905; 168 -9.525,-3.175; 169 -10.795,3.175; 170 -10.795,1.905; 171 -10.795,0.635; 172 -10.795,-0.635; 173 -10.795,-1.905; 174 -10.795,-3.175; 175 -12.065,3.175; 176 -12.065,1.905; 177 -12.065,0.635; 178 -12.065,-0.635; 179 -12.065,-1.905; 180 -12.065,-3.175; 181 -13.335,3.175; 182 -13.335,1.905; 183 -13.335,0.635; 184 -13.335,-0.635; 185 -13.335,-1.905; 186 -13.335,-3.175; 187 -14.605,3.175; 188 -14.605,1.905; 189 -14.605,0.635; 190 -14.605,-0.635; 191 -14.605,-1.905; 192 -14.605,-3.175; 193 -15.875,3.175; 194 -15.875,1.905; 195 -15.875,0.635; 196 -15.875,-0.635; 197 -15.875,-1.905; 198 -15.875,-3.175; 199 -17.145,3.175; 200 -17.145,1.905; 201 -17.145,0.635; 202 -17.145,-0.635; 203 -17.145,-1.905; 204 -17.145,-3.175; 205 -18.415,3.175; 206 -18.415,1.905; 207 -18.415,0.635; 208 -18.415,-0.635; 209 -18.415,-1.905; 210 -18.415,-3.175; 211 -19.685,3.175; 212 -19.685,1.905; 213 -19.685,0.635; 214 -19.685,-0.635; 215 -19.685,-1.905; 216 -19.685,-3.175; 217 -20.955,3.175; 218 -20.955,1.905; 219 -20.955,0.635; 220 -20.955,-0.635; 221 -20.955,-1.905; 222 -20.955,-3.175; 223 -22.225,3.175; 224 -22.225,1.905; 225 -22.225,0.635; 226 -22.225,-0.635; 227 -22.225,-1.905; 228 -22.225,-3.175; 229 -23.495,3.175; 230 -23.495,1.905; 231 -23.495,0.635; 232 -23.495,-0.635; 233 -23.495,-1.905; 234 -23.495,-3.175; 235 -24.765,3.175; 236 -24.765,1.905; 237 -24.765,0.635; 238 -24.765,-0.635; 239 -24.765,-1.905; 240 -24.765,-3.175 | hole 1.27: 27.191,0; -27.191,-3.048

### Placement (x,y rotation side)
3.3V_REG  14.48,48.26 180 bottom
5V_REG  27.94,48.26 180 bottom
BSPD_CONN  40.26,74.68 180 bottom
C1  90.17,36.83 270 bottom
C2  90.17,29.21 270 bottom
C3  90.17,21.59 270 bottom
C4  90.17,13.97 270 bottom
C5  69.98,79.5 0 bottom
C6  69.98,77.98 0 bottom
C7  84.58,73.66 180 bottom
C8  88.14,73.66 0 bottom
C9  23.37,48.26 270 bottom
C10  5.59,48.26 270 bottom
C11  25.4,46.23 90 bottom
C12  25.4,50.29 90 bottom
C13  69.98,76.45 180 bottom
C14  69.98,74.93 180 bottom
D1  66.17,38.48 270 bottom
D2  65.28,33.91 270 bottom
D3  6.64,62.45 0 bottom
D4  42.8,63.5 0 bottom
D5  19.3,12.19 180 bottom
D6  27.3,12.19 180 bottom
DASHBOARD_CONN  99.44,40.64 270 bottom
F  26.04,65.02 90 bottom
F1  16,65.02 90 bottom
F2  10.92,65.02 90 bottom
F3  47.75,65.15 270 top
F4  52.7,65.15 270 top
F5  57.78,65.15 270 top
F6  62.1,65.28 0 bottom
F7  21.46,10.41 0 bottom
F8  25.15,10.41 180 bottom
F9  55.63,4.45 90 top
F10  89.15,38.99 180 top
F11  91.44,54.61 90 bottom
F12  91.44,50.8 90 bottom
F13  91.44,46.99 90 bottom
F14  91.44,43.18 90 bottom
F15  88.9,61.59 270 bottom
F16  69.22,4.45 270 top
F17  61.21,31.37 180 bottom
F18  61.34,40.01 0 top
HV_BOX_CONN  20.07,2.16 0 bottom
PEDAL_CONN  47.62,2.16 0 bottom
Q1  18.41,63.5 0 bottom
Q2  13.39,63.5 0 bottom
Q3  88.9,47.62 90 bottom
Q4  88.9,43.81 90 bottom
Q5  88.9,51.44 90 bottom
Q6  88.9,55.24 90 bottom
Q7  64.26,30.73 0 bottom
Q8  62.1,43.56 180 top
Q9  62.61,61.47 0 bottom
Q10  58.67,64.39 0 bottom
Q11  16.13,58.04 0 bottom
Q13  32.13,59.56 270 bottom
Q14  95,73.91 90 top
Q15  95,64.01 90 top
Q16  95,67.31 90 top
Q17  95,70.61 90 top
R1  35.43,60.58 0 bottom
R2  19.43,60.07 90 bottom
R3  14.35,60.33 90 bottom
R4  63.63,58.67 90 bottom
R5  86.36,51.18 270 bottom
R6  80.77,46.99 0 bottom
R7  80.77,43.18 0 bottom
R8  17.78,15.24 180 bottom
R9  25.78,15.24 0 bottom
R10  80.77,54.61 0 bottom
R11  65.15,26.8 180 bottom
R12  63.12,46.86 270 top
R13  62.99,19.68 90 top
R14  67.82,32.38 270 bottom
R15  65.66,46.1 90 top
R16  59.69,26.54 270 bottom
R17  64.26,36.7 270 bottom
R18  80.77,50.8 180 bottom
R19  86.36,47.37 270 bottom
R20  86.36,43.56 270 bottom
R21  86.36,54.99 270 bottom
R22  61.98,63.88 0 bottom
R23  29.34,60.2 90 bottom
R24  22.99,60.07 270 bottom
R25  17.91,60.07 270 bottom
R26  97.66,71.63 90 top
R27  92.84,75.56 0 top
R28  97.66,63.63 270 top
R29  93.98,60.96 90 top
R30  97.66,66.29 90 top
R31  92.33,69.22 180 top
R32  97.66,68.96 90 top
R33  92.84,72.14 0 top
R34  43.05,61.09 180 bottom
R35  67.56,75.69 90 bottom
R36  83.82,41.78 0 bottom
SBRIO_ANALOG  61.09,18.54 0 bottom
SBRIO_AUX  61.34,34.8 0 bottom
SHOCK_POT_CONN  75.18,2.16 0 bottom
SHTDWN_CONN  10.92,74.68 180 bottom
THERM_CONN  99.44,13.08 270 bottom
THERMO_1  83.82,38.1 270 bottom
THERMO_2  83.82,30.48 270 bottom
THERMO_3  83.82,22.86 270 bottom
THERMO_4  83.82,15.24 270 bottom
U1  28.45,63.5 0 bottom
U2  86.36,70.48 0 bottom
U3  66.8,70.99 0 bottom
U$2  5.84,19.3 270 bottom
U$3  72.01,40.03 270 top
U$15  64.64,48.9 90 top
U$16  62.1,26.8 90 bottom
U$17  83.82,51.82 90 bottom
U$18  83.82,48.01 90 bottom
U$19  83.82,44.2 90 bottom
U$20  83.82,55.63 90 bottom
U$23  21.21,58.04 0 bottom
WHEEL_SPEED  99.44,68.2 270 bottom

### Tracks (layer width: path | path; a pad name or v marks a point on that pad's centre or on a via)
3.3V  (via drill 0.38)
  Top 0.406: Q15.P$3 95.94,64.9 95.5,64.9 95,65.41 95,68.2 | 95,68.2 95,71.5 | 95,71.5 95,73.03 | 95,73.03 95,74.86 Q14.P$3 | Q17.P$3 95.06,71.56 95,71.5 | Q16.P$3 95.06,68.26 95,68.2 | 89.24,71.71 v89.37,71.84 90.55,73.03 95,73.03
  Top 0.635: 35.31,63.12 35.31,65.91 42.29,72.9 v69.09,72.9
  Top 0.711: v82.97,71.71 89.24,71.71 | v27.18,54.99 v33.91,61.72 34.1,61.91 35.31,63.12
  Bottom 0.406: 89.95,20.95 C3.2 | 89.95,28.57 C2.2 | 89.95,36.2 C1.2 | THERMO_4.4 85.47,13.34 84.58,14.22 84.58,20.83 | THERMO_1.4 84.58,36.2 | 84.58,20.83 84.58,28.45 | 84.58,28.45 84.58,36.2 | 84.58,36.2 84.58,39.75 83.57,40.77 69.98,40.77 69.22,41.53 58.67,41.53 38.48,61.72 v33.91,61.72 | THERMO_2.4 84.71,28.57 84.58,28.45 | THERMO_3.4 84.71,20.95 84.58,20.83 | 89.95,13.34 C4.2 | C7.1 84.36,73.03 U2.1 83.1,71.58 v82.97,71.71 82.72,71.97 U3.1 U3.16 | U2.6 88.36,73.03 C8.1 | U2.6 88.4,71.63 | U3.15 U3.16 | C6.1 71.5,77.98 71.88,77.6 71.88,74.04 70.74,72.9 v69.09,72.9 67.78,72.9 U3.16 | v89.37,71.84 89.11,71.58 U2.6 | C9.1 19.56,52.92 3.3V_REG.5 20.78,54.99 v27.18,54.99
  Bottom 0.711: THERMO_3.4 89.95,20.95 | THERMO_2.4 89.95,28.57 | THERMO_1.4 89.95,36.2 | THERMO_4.4 89.95,13.34 | C5.1 C6.1
5V  (via drill 0.38)
  Top 0.406: 5V_REG.P$3 44.32,50.8 v46.48,48.64 | Q8.P$3 57,40.41 57.02,40.39 v57.02,38.23
  Top 1.016: 5V_REG.P$3 20.07,50.8 10.29,41.02 10.29,10.67 15.86,5.09 F9.2 F16.1 75.96,5.09 83.82,12.95 83.82,34.8 88.01,38.99 F10.2
  Bottom 0.406: v46.48,48.64 46.61,48.64 v57.02,38.23
  Bottom 1.016: C12.2 27.6,51.14 5V_REG.P$3
12V  (via drill 0.38, 0.64)
  Top 0.635: v59.69,29.72 52.58,29.72 v50.37,31.93
  Top 0.965: v60.83,56.64 v55.75,51.56
  Bottom 0.203: 50.37,37.47 50.37,34.16
  Bottom 0.406: 17.53,63.47 21.08,63.47 | Q1.P$3 17.46,63.41 17.53,63.47 | 17.53,63.47 12.45,63.47 | 12.45,63.47 6.65,63.47 | 12.45,63.47 12.44,63.46 Q2.P$3 12.44,56.81 3.3V_REG.1 9.4,52.92 C10.1 | 27.43,63.47 21.08,63.47 | SHTDWN_CONN.6 21.08,67.34 21.08,63.47 | U1.P$3 27.5,63.4 27.43,63.47 | 5V_REG.P$1 43.31,45.72 50.37,38.66 50.37,37.47 | v50.37,31.93 50.37,34.16 | 88.9,57.66 88.9,52.32 | 88.9,52.32 88.9,48.64 | 88.9,48.64 88.9,45.77 Q4.P$3 | Q3.P$3 88.83,48.58 88.9,48.64 | Q5.P$3 88.84,52.38 88.9,52.32 | v55.75,51.56 66.55,51.56 67.06,52.07 68.83,52.07 70.1,50.8 73.15,50.8 80.01,57.66 86.44,57.66 Q6.P$3 | 27.43,63.47 57.65,63.47 Q10.P$3
  Bottom 0.711: F15.2 88.9,57.66 88.9,57.2 Q6.P$3 | Q7.P$3 63.3,29.72 v59.69,29.72
  Bottom 0.762: v60.83,56.64 57.72,59.75 Q10.P$3
  Bottom 1.016: U1.P$3 27.5,56.45 29.59,54.36 29.59,47.37 5V_REG.P$1 27.6,45.38 C11.1
  Bottom 1.651: SHTDWN_CONN.5 23.42,72.18 SHTDWN_CONN.6
  pour Bottom (isolate 0.381): 54.23,52.83 54.23,50.29 57.02,50.29 63.37,43.94 89.92,43.94 89.92,64.01 84.71,64.01 73.53,52.83
  pour Bottom: 3.17,48.39 3.17,62.36 5.59,64.77 13.59,64.77 19.05,70.23 19.05,75.69 19.56,76.2 24.51,76.2 28.07,72.64 28.07,65.66 29.46,64.26 58.8,64.26 60.45,62.61 60.45,59.05 62.48,57.02 62.48,53.98 61.34,52.83 50.04,52.83 47.75,50.55 47.75,47.5 51.44,43.81 51.44,36.83 44.07,44.2 24.38,44.2 24.38,46.35 28.19,46.35 29.34,47.5 29.34,52.83 23.75,58.42 14.73,58.42 13.72,57.4 13.72,56.01 6.1,48.39
AI1  (via drill 0.38)
  Top 0.203: 56.08,19.18 56.08,17.91
  Top 0.406: 56.08,17.91 56.08,16.08 52.83,12.83 v38.73,12.83 | SBRIO_ANALOG.P$6 56.08,19.54 56.08,19.18
  Bottom 0.406: HV_BOX_CONN.P$5 v38.73,12.83
AI2  (via drill 0.38)
  Top 0.203: 46.35,34.04 46.35,37.47 | 54.1,19.18 54.1,17.91
  Top 0.406: SBRIO_ANALOG.P$8 54.1,19.56 54.1,19.18 | 46.35,37.47 46.35,44.7 57.76,56.11 57.76,64.47 F5.2 | 54.1,17.91 54.1,16.76 51.18,13.84 v37.72,13.84
  Top 0.635: SBRIO_ANALOG.P$8 55.09,24.67 46.35,33.4 46.35,34.04
  Bottom 0.406: HV_BOX_CONN.P$6 37.72,13.81 v37.72,13.84
AI3  (via drill 0.38)
  Top 0.203: 44.32,34.04 44.32,37.47 | 52.07,19.05 52.07,17.91 52.07,17.53
  Top 0.406: 44.32,37.47 44.32,43.94 52.76,52.38 52.76,64.45 F4.2 | SBRIO_ANALOG.P$12 52.07,19.56 52.07,19.05 | v52.07,16.13 52.07,17.91
  Top 0.635: SBRIO_ANALOG.P$12 51.09,26.38 44.32,33.15 44.32,34.04
  Bottom 0.406: PEDAL_CONN.P$7 52.07,2.6 v52.07,16.13
AI4
  Top 0.203: 42.34,34.04 42.34,37.47
  Top 0.406: 42.34,37.47 42.34,43.23 50.67,51.56 50.67,53.09 47.75,56.01 F3.2
  Top 0.635: SBRIO_ANALOG.P$14 49.09,26.35 42.34,33.1 42.34,34.04
  Bottom 0.203: 50.1,19.18 50.1,17.91
  Bottom 0.406: PEDAL_CONN.P$8 50.1,2.63 50.1,17.91 | 50.1,19.18 50.1,19.53 SBRIO_ANALOG.P$14
AI7
  Bottom 0.203: 40.08,17.91 40.08,19.18 40.08,19.5
  Bottom 0.406: PEDAL_CONN.P$4 40.08,3.7 40.08,17.91 | SBRIO_ANALOG.P$24 40.08,19.55 40.08,19.18
AI8
  Bottom 0.406: SHOCK_POT_CONN.P$8 68.17,11.18 66.45,11.18 SBRIO_ANALOG.P$3
AI9
  Bottom 0.406: SHOCK_POT_CONN.P$1 67.06,10.29 65.34,10.29 SBRIO_ANALOG.P$5
AI10
  Bottom 0.406: SHOCK_POT_CONN.P$2 65.94,9.4 62.23,9.4 SBRIO_ANALOG.P$9
AI11
  Top 0.203: 49.78,19.56 48.48,19.56 48.1,19.94 48.1,21.21
  Top 0.406: SBRIO_ANALOG.P$11 50.07,19.56 49.78,19.56
  Top 0.635: SBRIO_AUX.P$33 31.5,32.64 38.1,32.64 48.1,22.64 48.1,21.21
  Bottom 0.406: SHOCK_POT_CONN.P$3 64.83,8.51 61.12,8.51 SBRIO_ANALOG.P$11
AI12
  Top 0.203: 46.1,21.21 46.1,19.94
  Top 0.406: SBRIO_ANALOG.P$15 46.1,19.53 46.1,19.94
  Top 0.635: SBRIO_AUX.P$35 30.39,31.75 36.96,31.75 46.1,22.61 46.1,21.21
AI13
  Top 0.203: 44.07,21.21 44.07,19.94
  Top 0.406: SBRIO_ANALOG.P$17 44.07,19.56 44.07,19.94
  Top 0.635: SBRIO_AUX.P$37 29.28,30.86 35.81,30.86 44.07,22.61 44.07,21.21
AI15
  Top 0.203: SBRIO_ANALOG.P$23 38.1,19.53 38.1,19.94 38.1,21.21
  Top 0.635: SBRIO_AUX.P$41 27.06,29.08 31.62,29.08 38.1,22.61 38.1,21.21
AMS_OK
  Bottom 0.711: D6.P$1 26.53,10.41 F8.2
AMS_OUT
  Bottom 0.711: F12.2 89.92,51.45 Q5.P$1
AO0
  Top 0.635: SBRIO_AUX.P$43 25.95,28.19 27.43,28.19 SBRIO_ANALOG.P$28
AO1
  Top 0.635: SBRIO_AUX.P$45 24.83,27.3 26.32,27.3 SBRIO_ANALOG.P$30
AO2
  Top 0.635: SBRIO_AUX.P$47 23.72,26.42 25.21,26.42 SBRIO_ANALOG.P$32
AO3
  Top 0.635: SBRIO_AUX.P$49 22.61,25.53 24.1,25.53 SBRIO_ANALOG.P$34
BSPD_OUT
  Bottom 0.711: F14.2 89.92,43.83 Q4.P$1
BUZZER_OUT
  Bottom 0.711: Q6.P$1 89.92,55.26 F11.2
CAN_GND
  Top 1.016: U$2.P$6 U$2.P$3
  Bottom 0.406: U$2.P$3 12.19,16.76 12.19,10.03 HV_BOX_CONN.P$1
CAN_H
  Bottom 0.406: U$2.P$7 10.41,13.46 10.41,7.81 HV_BOX_CONN.P$3 17.08,1.14 98.93,1.14 100.46,2.67 100.46,31.75 98.17,34.04 98.17,37.37 DASHBOARD_CONN.P$2
CAN_L
  Bottom 0.406: U$2.P$2 5.84,23.11 5.84,10.38 HV_BOX_CONN.P$4 15.72,0.51 99.19,0.51 101.09,2.41 101.09,34.99 DASHBOARD_CONN.P$3
DIO0  (via drill 0.38)
  Top 0.711: v77.09,62.87 77.09,67.44 83.57,73.91 Q14.P$1 94,75.06 R27.2
  Bottom 0.406: U$3.228 76.48,62.26 v77.09,62.87
  other vias: 68.83,62.26
DIO1  (via drill 0.38)
  Top 0.406: U$3.216 67.79,59.72 v67.06,60.45 | Q17.P$1 92.58,70.61 92.2,70.23 83.44,70.23 78.74,65.53 v78.74,63.25
  Top 0.711: R33.2 94,71.63 Q17.P$1
  Bottom 0.406: v67.06,60.45 75.95,60.45 v78.74,63.25
DIO2  (via drill 0.38)
  Top 0.406: v80.39,63.63 80.39,66.17 83.69,69.47 90.81,69.47 91,69.28 | Q16.P$1 92.96,67.31 91,69.28 | R31.2 91.61,69.28 91,69.28
  Bottom 0.406: v80.39,63.63 76.2,59.44 69.83,59.44 U$3.210
  other vias: 68.83,58.45
DIO3  (via drill 0.38)
  Top 0.406: Q15.P$1 93.6,64.01 92.33,65.28 92.33,66.93 90.55,68.71 83.95,68.71 82.04,66.8 v82.04,64.01
  Top 0.711: R29.2 93.98,63.99 Q15.P$1
  Bottom 0.406: v82.04,64.01 73.53,55.5 69.24,55.5 U$3.198
  other vias: 68.83,55.91
DIO6  (via drill 0.38)
  Bottom 0.406: U$3.174 70,49.66 78.98,49.66 R18.1
  other vias: 68.83,50.83
DIO7  (via drill 0.38)
  Bottom 0.406: U$3.162 78.83,48.28 R6.2
  other vias: 68.83,48.29
DIO8  (via drill 0.38)
  Top 0.406: U$3.156 68.83,46.99 v67.82,45.97
  Bottom 0.406: v67.82,45.97 68.58,45.97 71.37,43.18 R7.2
DIO9  (via drill 0.38)
  Bottom 0.406: R36.2 71.53,41.78 U$3.144
  other vias: 68.83,44.48
DIO10  (via drill 0.38)
  Bottom 0.406: U$3.138 58.27,43.2 43.75,57.72 43.75,61.04 R34.2 43.7,62.45 D4.P$2
  other vias: 68.83,43.21
DIO11  (via drill 0.38)
  Bottom 0.406: U$3.126 58.27,40.66 40.2,58.74 39.89,59.04 38.35,60.58 R1.1
  other vias: 68.83,40.67
DIO12  (via drill 0.38)
  Bottom 0.406: D2.P$2 68.83,37.41 U$3.120
  Bottom 0.711: D2.P$2 67.82,33.32 R14.1
  other vias: 68.83,39.4
DIO13  (via drill 0.38)
  Top 0.406: U$3.108 65.53,40.16 v65.53,44.2 | v63.63,56.9 v57.02,50.29
  Bottom 0.406: v57.02,50.29 63.12,44.2 v65.53,44.2
  Bottom 0.711: R4.1 v63.63,56.9
DIO14  (via drill 0.38)
  Top 0.406: SBRIO_AUX.P$3 60.74,33.4 66.65,33.4 U$3.102 | v79.38,32.38 79.38,35.31 83.82,39.75 83.82,49.28 v80.14,52.96
  Bottom 0.406: v79.38,32.38 72.03,32.38 U$3.102 | v80.14,52.96 80.14,54.59 R10.2
  other vias: 68.83,35.59
DIO15
  Top 0.406: U$3.90 68.3,32.51 59.63,32.51 SBRIO_AUX.P$5
DIO16  (via drill 0.38)
  Top 0.203: 68.33,64.16 72.01,64.16 U$3.231 | 48.36,34.04 48.36,35.43
  Top 0.406: 68.33,64.16 67.08,64.16 47.34,44.42 SBRIO_AUX.P$16 48.36,35.78 48.36,35.43
  Top 0.635: v59.69,28.19 52.83,28.19 48.36,32.66 48.36,34.04
  Bottom 0.711: R16.1 v59.69,28.19
DIO17
  Top 0.203: 68.33,62.89 71.63,62.89 72.26,62.26 U$3.225
  Top 0.406: SBRIO_AUX.P$14 49.34,43.88 62.87,57.4 62.87,58.8 66.95,62.89 68.33,62.89
DIO18
  Top 0.203: 67.39,59.08 72.01,59.08 U$3.213
  Top 0.406: SBRIO_AUX.P$12 51.34,43.34 67.08,59.08 67.39,59.08
DIO19  (via drill 0.38)
  Top 0.406: SBRIO_AUX.P$10 53.34,44.07 v65.66,56.39
  Bottom 0.305: 67.94,56.39 68.25,56.39 68.45,56.59 69.22,56.59 69.67,56.13
  Bottom 0.406: 67.94,56.39 v65.66,56.39 | U$3.207 70.33,56.13 69.67,56.13
  other vias: 72.64,58.45
DIO20  (via drill 0.38)
  Top 0.127: U$3.195 72.64,55.88
  Top 0.203: v67.54,55.27 72.01,55.27 U$3.195
  Top 0.406: v43.05,54.61 v48.01,54.61
  Bottom 0.406: v43.05,54.61 58.23,39.43 66.04,39.43 | v48.01,54.61 66.88,54.61 v67.54,55.27 | R17.1 65.67,37.35 66.17,37.85 66.17,39.3 66.04,39.43 | D1.P$2 66.04,39.43
DIO29  (via drill 0.38)
  Top 0.406: v89.79,66.04 89.79,45.59 89.79,44.58 v80.39,35.18
  Bottom 0.406: v89.79,66.04 89.79,69.98 89.28,70.48 U2.7 | v80.39,35.18 76.86,35.18 U$3.117
  other vias: 72.64,39.4
DIO30  (via drill 0.38)
  Top 0.406: v85.16,67.13 89.97,67.13 90.68,66.42 90.68,45.47 90.68,44.45 90.68,44.32 v80.64,34.29
  Bottom 0.406: U3.4 80.35,70.02 83.24,67.13 v85.16,67.13 U2.12 | v80.64,34.29 75.21,34.29 U$3.105
  other vias: 72.64,36.86
DIO31  (via drill 0.38)
  Top 0.406: v84.36,67.98 90.27,67.98 91.57,66.67 91.57,44.07 v80.9,33.4
  Bottom 0.406: U3.3 80.72,70.67 83.41,67.98 v84.36,67.98 U2.13 | v80.9,33.4 74.83,33.4 U$3.99
  other vias: 72.64,35.59
DIO32  (via drill 0.38)
  Top 0.203: U$3.221 69.47,61.62 68.17,61.62 v67.94,61.85
  Top 0.635: v67.44,65.02 v67.44,71.25
  Bottom 0.406: U2.14 81.92,70.48 81.08,71.32 U3.2 67.51,71.32 v67.44,71.25 | v67.44,65.02 67.44,62.36 v67.94,61.85
DIO33  (via drill 0.38)
  Top 0.203: v67.06,61.47 68.17,60.35 69.09,60.35 69.72,59.72 U$3.215
  Bottom 0.406: v67.06,61.47 66.55,61.98 66.55,65.41 67.78,66.63 U3.5
DIO34  (via drill 0.38)
  Bottom 0.406: U3.7 66.48,67.87 64.77,66.17 64.77,58.67 66.27,57.17 U$3.203
  other vias: 70.1,57.18
DIO35  (via drill 0.38)
  Top 0.203: v67.69,58.42 67.69,57.23 68.38,56.54 69.47,56.54 U$3.197
  Bottom 0.406: v67.69,58.42 66.29,58.42 65.66,59.05 65.66,65.79 67.13,67.25 U3.6
DIO36  (via drill 0.38)
  Top 0.406: v88.36,66.04 v85.34,66.04
  Bottom 0.406: U$3.185 70.46,53.72 73.03,53.72 85.22,65.91 v85.34,66.04 | U2.8 v88.36,66.04
  other vias: 70.1,53.37
DIO37  (via drill 0.38)
  Top 0.127: U$3.179 70.1,52.12
  Top 0.406: 70.1,52.12 70.13,52.12 v70.74,52.73
  Bottom 0.406: U2.9 87.56,66.99 73.53,52.96 70.97,52.96 v70.74,52.73
DIO38
  Top 0.203: 68.28,48.92 69.47,48.92 U$3.167
  Top 0.406: SBRIO_AUX.P$8 56.26,37.72 56.26,43.18 62.87,49.78 64.26,49.78 65.13,48.92 68.28,48.92
DIO39
  Top 0.203: 68.33,47.65 69.47,47.65 U$3.161
  Top 0.406: 68.33,47.65 67.46,47.65 66.67,46.86 66.67,46.1 66.03,45.45 R15.1
GND  (via drill 0.38, 3.17 pad 3.81)
  Top 0.203: 72.01,43.84 72.01,42.57 U$3.129 | 72.01,47.65 72.01,46.38 U$3.147 | U$3.178 72.01,51.46 72.01,50.19 U$3.165 | U$3.96 69.47,33.68 70.74,33.68 U$3.88 | U$3.119 70.74,38.76 72.01,38.76 U$3.111 | U$3.142 72.01,43.84 | 72.01,43.84 73.28,43.84 U$3.134 | U$3.183 72.01,54 70.74,54 U$3.191 | 72.01,47.65 73.28,47.65 U$3.152 | U$3.160 72.01,47.65 | U$3.209 70.74,57.81 72.01,57.81 U$3.201 73.28,56.54 74.55,56.54 U$3.193 | U$3.211 74.55,60.35 74.55,61.62 U$3.224 73.28,62.89 | U$3.237 73.28,64.16 73.28,62.89 | 73.28,62.89 72.39,62.89 71.75,63.52 U$3.232 | U$3.214 70.74,60.35 69.85,60.35 69.22,60.98 U$3.222 | U$3.219 72.01,61.62 70.74,61.62 U$3.227
  Top 0.406: U$3.229 U$3.224 U$3.219 U$3.214 | U$3.114 U$3.119 U$3.124 U$3.129 | U$3.96 U$3.101 U$3.106 U$3.111 U$3.116 U$3.121 | U$3.103 U$3.98 U$3.93 U$3.88 U$3.83 U$3.78 65.97,30.5 | U$3.17 U$3.23 U$3.30 68.83,21.59 U$3.36 U$3.41 U$3.47 | U$3.132 U$3.137 U$3.142 U$3.147 | U$3.134 U$3.139 | U$3.152 U$3.157 | U$3.170 U$3.165 U$3.160 U$3.155 U$3.150 | U$3.186 U$3.191 | U$3.204 U$3.209 | U$3.211 U$3.206 U$3.201 U$3.196 | U$3.175 75.95,52.86 75.95,55.14 U$3.193 U$3.188 U$3.183 U$3.178 U$3.173 U$3.168 68.54,49.84 U$15.P$3 | 59.09,23.62 59.09,23.72 59.18,23.72 65.97,30.5 | 59.09,23.62 SBRIO_ANALOG.P$4 | 59.09,23.62 62.48,23.62 64.49,21.61 64.49,21.59 | 65.97,30.5 59.63,30.5 SBRIO_AUX.P$7 | R13.1 61.58,19.04 SBRIO_ANALOG.P$1 | v32.64,61.98 32.64,68.89 SHTDWN_CONN.10 | R29.1 100.58,53.71 100.58,14.22 THERM_CONN.P$1
  Top 0.635: 64.49,21.59 68.83,21.59
  Top 0.711: R31.1 v94.11,69.22 | R33.1 v91.19,72.14 | R27.1 v91.19,75.56
  Top 0.762: v74.93,76.83 72.64,74.55 U$3.237
  Top 1.308: SBRIO_AUX.P$50 SBRIO_AUX.P$48 SBRIO_AUX.P$46 SBRIO_AUX.P$44 SBRIO_AUX.P$42 SBRIO_AUX.P$40 SBRIO_AUX.P$38 SBRIO_AUX.P$36 SBRIO_AUX.P$34 SBRIO_AUX.P$32 SBRIO_AUX.P$30 SBRIO_AUX.P$28 SBRIO_AUX.P$26 SBRIO_AUX.P$24 | SBRIO_AUX.P$24 SBRIO_AUX.P$22 | SBRIO_AUX.P$31 SBRIO_AUX.P$29 SBRIO_AUX.P$27 SBRIO_AUX.P$25 SBRIO_AUX.P$23 | SBRIO_AUX.P$23 SBRIO_AUX.P$21 | SBRIO_AUX.P$23 SBRIO_AUX.P$24 | SBRIO_AUX.P$13 SBRIO_AUX.P$11 SBRIO_AUX.P$9 SBRIO_AUX.P$7 | SBRIO_ANALOG.P$26 SBRIO_ANALOG.P$25 SBRIO_ANALOG.P$27 SBRIO_ANALOG.P$29 SBRIO_ANALOG.P$31 SBRIO_ANALOG.P$33 SBRIO_ANALOG.P$35 SBRIO_ANALOG.P$37 SBRIO_ANALOG.P$39 SBRIO_ANALOG.P$41 SBRIO_ANALOG.P$43 SBRIO_ANALOG.P$45 SBRIO_ANALOG.P$47 SBRIO_ANALOG.P$49
  Bottom 0.406: 90.26,14.73 C4.1 91.31,14.82 | 91.31,37.59 91.31,29.84 | 91.31,29.84 91.31,22.35 | 91.31,22.35 91.31,14.82 | C2.1 91.1,30.06 91.31,29.84 | C3.1 91.22,22.44 91.31,22.35 | U2.2 85.16,73.39 C7.2 | 86.42,40.03 THERMO_1.1 | SBRIO_ANALOG.P$19 SBRIO_ANALOG.P$22 41.09,22.04 41.27,22.23 | SBRIO_ANALOG.P$13 SBRIO_ANALOG.P$16 47.09,21.94 47.37,22.23 | 52.96,22.23 57.4,22.23 SBRIO_ANALOG.P$4 SBRIO_ANALOG.P$1 63.12,16.51 | 52.96,22.23 47.37,22.23 | 47.37,22.23 41.27,22.23 | 41.27,22.23 38.77,22.23 SBRIO_ANALOG.P$26 | 52.96,22.23 53.09,22.1 SBRIO_ANALOG.P$10 SBRIO_ANALOG.P$7 | 63.12,16.51 67.44,12.19 69.15,12.19 SHOCK_POT_CONN.P$7 84.11,7.08 THERM_CONN.P$4 THERM_CONN.P$3 THERM_CONN.P$2 THERM_CONN.P$1 93.05,13.08 91.31,14.82 | U2.5 U2.4 86.76,73.13 C8.2 84.75,76.2 | 65.83,74.84 R35.1 67.65,74.93 | 90.17,37.97 C1.1 90.26,37.59 91.31,37.59 | 100.71,41.66 95.38,41.66 91.31,37.59 | 17.13,18.5 SBRIO_ANALOG.P$45 | 25.13,18.5 SBRIO_ANALOG.P$37 | C11.2 26.58,48.26 5V_REG.P$2 | C11.2 C12.1 | v3.2,3.2 3.2,47.41 | v74.93,76.83 84.11,76.83 84.75,76.2 | WHEEL_SPEED.P$5 91.19,76.2 | 91.19,76.2 84.75,76.2 | C5.2 65.83,79.5 | 65.83,79.5 35.75,79.5 SHTDWN_CONN.9 28.76,76.83 v3.2,76.83 1.65,75.29 1.65,47.41 3.2,47.41 | 65.83,74.84 U3.13 U3.12 U3.11 U3.10 U3.9 U3.8 65.83,68.49 63.88,66.55 63.88,62.23 63.12,61.47 62.66,61.47 Q9.P$3 | 65.83,74.84 65.83,79.5 | 3.3V_REG.7 17.34,42.43 SBRIO_AUX.P$46 | 3.3V_REG.7 21.68,47.41 C9.2 23.7,47.08 C11.2 | 3.2,47.41 C10.2 11.94,47.41 | U$23.P$3 18.85,55.63 15.18,55.63 | 15.18,55.63 Q11.P$3 | 3.3V_REG.7 3.3V_REG.9 11.94,47.41 | v91.19,72.14 v91.19,75.56 91.19,76.2 | R36.1 84.47,42.53 83.82,43.18 83.82,45.15
  Bottom 0.406: 83.82,52.77 83.82,55.58 U$20.P$3 | 83.82,52.77 83.82,48.96 | 83.82,48.96 83.82,45.15 | U$19.P$3 83.82,45.15 | U$18.P$3 83.82,48.96 | U$17.P$3 83.82,52.77 | U$16.P$3 62.1,26.75 62.1,21.59 63.12,20.57 | 63.12,20.57 63.12,16.51 | 11.94,47.41 11.94,52.38 15.18,55.63 | 66.93,30.5 65.28,32.16 65.28,35.04 R17.2 | 66.93,30.5 66.93,24.38 63.12,20.57 | 66.93,30.5 67.82,31.39 R14.2 | Q13.P$3 32.13,59.61 32.13,61.47 v32.64,61.98 33.15,62.48 38.99,62.48 40.39,61.09 R34.1
  Bottom 0.711: C4.1 89.11,15.88 THERMO_4.2 THERMO_4.1 | THERMO_1.1 THERMO_1.2 89.11,38.73 C1.1 | THERMO_2.1 THERMO_2.2 89.11,31.11 C2.1 | THERMO_3.1 THERMO_3.2 89.11,23.5 C3.1 | C7.2 C8.2 | R36.1 86.42,40.03 | C14.1 67.65,74.93 | R8.1 17.13,18.5 | R9.2 25.13,18.5 | C5.2 C6.2 | v94.11,69.22 v91.19,72.14
  Bottom 1.308: SBRIO_AUX.P$22 SBRIO_AUX.P$20 SBRIO_AUX.P$18 | SBRIO_AUX.P$21 SBRIO_AUX.P$19 SBRIO_AUX.P$17 SBRIO_AUX.P$15 SBRIO_AUX.P$13
  Bottom 1.651: SHTDWN_CONN.10 33.42,72.18 SHTDWN_CONN.9
  pour Bottom (isolate 0.254, rank 5): 0.64,80.64 100.97,80.64 100.97,0.64 0.64,0.64
  pour Top (isolate 0.254, rank 5): 0.64,80.64 100.97,80.64 100.97,0.64 0.64,0.64
IMD_OK
  Bottom 0.711: D5.P$1 20.08,10.41 F7.2
IMD_OUT
  Bottom 0.711: F13.2 89.92,47.64 Q3.P$1
N$1
  Bottom 0.406: D2.P$1 64.23,33.91 SBRIO_AUX.P$2
N$2
  Bottom 0.406: D1.P$1 61.02,38.48 SBRIO_AUX.P$4
N$3
  Top 0.711: R32.1 99.33,68.31 WHEEL_SPEED.P$1
N$4  (via drill 0.38)
  Top 0.406: R13.2 61.29,20.34 SBRIO_ANALOG.P$2
  Top 0.635: v28.57,58.17 25.15,61.47 v9.02,61.47
  Bottom 0.203: 58.34,34.16 58.34,34.29 58.34,37.47
  Bottom 0.406: v9.02,61.47 9,61.45 | SBRIO_ANALOG.P$2 58.34,23.29 58.34,34.29 | 58.34,37.47 58.34,38.05 39.81,56.58 30.16,56.58 v28.57,58.17
  Bottom 0.711: 9,61.45 D3.P$2
N$5
  Bottom 0.711: R21.2 87.85,54.34 Q6.P$2
N$6
  Top 0.711: R30.2 96.58,66.94 Q16.P$2
N$7
  Bottom 0.711: Q1.P$1 16.13,64.5 F1.1
N$8
  Bottom 0.711: Q2.P$1 11.05,64.5 F2.1
N$9
  Top 0.711: R28.1 99.36,64.28 WHEEL_SPEED.P$3
N$10
  Top 0.711: R26.1 98.66,70.98 WHEEL_SPEED.P$8
N$11  (via drill 0.38)
  Top 0.406: v48.9,53.72 26.8,53.72 24.38,56.13 v24.38,60.33
  Bottom 0.406: v48.9,53.72 69.22,53.72 70.13,54.63 U$3.189
  Bottom 0.711: R24.1 23.99,60.72 v24.38,60.33
  other vias: 72.64,54.64
N$12  (via drill 0.38)
  Top 0.406: v49.78,52.83 24,52.83 v16.38,60.45
  Bottom 0.406: v49.78,52.83 69.34,52.83 70.36,51.82 72.36,51.82 U$3.177
  Bottom 0.711: R25.1 16.65,60.72 v16.38,60.45
  other vias: 72.64,52.1
N$13
  Bottom 0.711: HV_BOX_CONN.P$7 24.5,2.59 F8.1
N$14
  Bottom 0.711: HV_BOX_CONN.P$8 22.11,2.21 F7.1
N$15  (via drill 0.38)
  Top 0.406: v54.36,38.73 54.36,43.81 63.5,52.96 67.16,52.96 U$3.192
  Bottom 0.203: 54.36,37.47 54.36,34.16 | 20.07,21.21 20.07,17.91
  Bottom 0.406: 54.36,34.16 54.36,33.53 51.05,30.23 27.43,30.23 20.07,22.86 20.07,21.21 | v54.36,38.73 54.36,37.47 | 18.43,13.27 D5.P$2 | 20.07,17.91 20.07,16.88 R8.2
  Bottom 0.711: R8.2 18.43,13.27
N$16  (via drill 0.38)
  Top 0.406: U$3.180 63.91,52.09 55.37,43.56 v55.37,38.73
  Bottom 0.203: 56.34,34.16 56.34,37.47 | 28.07,17.91 28.07,21.08
  Bottom 0.406: 56.34,34.16 56.34,33.48 52.2,29.34 34.54,29.34 28.07,22.86 28.07,21.08 | 26.43,13.27 D6.P$2 | 28.07,17.91 28.07,16.88 R9.1 | 56.34,37.47 56.34,37.77 v55.37,38.73
  Bottom 0.711: R9.1 26.43,13.27
N$17  (via drill 0.38)
  Top 0.203: 75.69,51.46 73.28,51.46 U$3.171
  Top 0.406: 75.69,51.46 77.32,51.46 82.93,45.85 v82.93,40.01
  Bottom 0.406: THERMO_1.7 82.93,38.73 | THERMO_4.7 82.3,15.88 82.93,16.51 82.93,23.5 | THERMO_3.7 82.93,23.5 | 82.93,23.5 82.93,31.11 | 82.93,31.11 82.93,38.73 | THERMO_2.7 82.93,31.11 | 82.93,38.73 v82.93,40.01
N$18  (via drill 0.38)
  Top 0.203: 75.69,48.92 73.28,48.92 U$3.159
  Top 0.406: v77.85,29.46 78.11,29.46 78.61,29.97 v78.61,36.2 80.26,37.85 80.26,38.86 80.26,39.12 80.26,44.96 76.3,48.92 75.69,48.92
  Bottom 0.406: THERMO_4.5 79.63,13.34 77.85,15.11 77.85,20.83 | 77.85,20.83 77.85,28.45 | THERMO_2.5 77.98,28.57 77.85,28.45 | THERMO_3.5 77.98,20.95 77.85,20.83 | v77.85,29.46 77.85,28.45 | THERMO_1.5 v78.61,36.2
N$20
  Top 0.711: F16.2 69.18,3.76 SHOCK_POT_CONN.P$4
N$21
  Bottom 0.406: 99.39,62.24 WHEEL_SPEED.P$4
  Bottom 0.711: F15.1 99.39,62.24
N$22
  Top 0.711: F9.1 PEDAL_CONN.P$5
N$23
  Top 0.711: F10.1 95.09,38.99 DASHBOARD_CONN.P$4
N$24
  Bottom 0.711: F11.1 94.12,53.96 DASHBOARD_CONN.P$5
N$25  (via drill 0.38)
  Top 0.203: 75.69,46.38 73.28,46.38 U$3.153
  Top 0.406: v79.38,38.1 79.38,44.07 77.06,46.38 75.69,46.38
  Bottom 0.406: v79.38,38.1 80.01,37.47 THERMO_1.6
N$26  (via drill 0.38)
  Top 0.203: 75.69,45.11 73.28,45.11 U$3.141
  Top 0.406: v77.72,31.11 77.72,43.69 76.3,45.11 75.69,45.11
  Bottom 0.406: THERMO_2.6 78.99,29.84 v77.72,31.11
N$27  (via drill 0.38)
  Top 0.203: U$3.135 73.28,42.57 75.69,42.57
  Top 0.406: v78.74,24 76.83,25.91 76.83,41.91 76.17,42.57 75.69,42.57
  Bottom 0.406: THERMO_3.6 79.88,22.23 78.74,23.37 v78.74,24
N$28  (via drill 0.38)
  Top 0.203: U$3.123 73.28,41.3 75.54,41.3 76.07,40.77
  Top 0.406: 76.07,40.77 76.07,18.41 v78.74,15.75
  Bottom 0.406: THERMO_4.6 79.88,14.61 v78.74,15.75
N$29  (via drill 0.38)
  Top 0.711: THERM_CONN.P$5 88.52,32 v88.52,37.47
  Bottom 0.711: THERMO_1.3 v88.52,37.47
N$30  (via drill 0.38)
  Top 0.711: THERM_CONN.P$6 88.68,29.84 v88.52,29.84
  Bottom 0.711: THERMO_2.3 v88.52,29.84
N$31  (via drill 0.38)
  Top 0.711: THERM_CONN.P$7 94.3,22.23 v88.52,22.23
  Bottom 0.711: THERMO_3.3 v88.52,22.23
N$32  (via drill 0.38)
  Top 0.711: THERM_CONN.P$8 98.97,14.61 v88.52,14.61
  Bottom 0.711: THERMO_4.3 v88.52,14.61
N$33
  Bottom 0.711: F12.1 95.93,50.15 DASHBOARD_CONN.P$6
N$34
  Bottom 0.711: F13.1 97.74,46.34 DASHBOARD_CONN.P$7
N$35
  Bottom 0.711: F14.1 99.33,42.53 DASHBOARD_CONN.P$8
N$36
  Bottom 0.711: F.2 26.04,67.29 SHTDWN_CONN.8
  Bottom 1.651: SHTDWN_CONN.7 28.42,72.18 SHTDWN_CONN.8
N$37
  Bottom 0.406: U3.14 66.48,73.59 66.67,73.79 70.23,73.79 70.83,74.38 C14.2
  Bottom 0.711: C13.2 C14.2
N$38
  Bottom 0.406: 67.65,76.45 R35.2
  Bottom 0.711: C13.1 67.65,76.45
N$39
  Bottom 0.711: F1.2 16,67.26 SHTDWN_CONN.4
  Bottom 1.651: SHTDWN_CONN.3 18.42,72.18 SHTDWN_CONN.4
N$40
  Bottom 0.711: F2.2 10.92,67.18 SHTDWN_CONN.2
  Bottom 1.651: SHTDWN_CONN.1 13.42,72.18 SHTDWN_CONN.2
N$41
  Bottom 0.711: F6.1 BSPD_CONN.10
  Bottom 1.651: BSPD_CONN.9 62.76,72.18 BSPD_CONN.10
N$42
  Bottom 0.406: 42.8,69.64 BSPD_CONN.2
  Bottom 0.711: D4.P$1 42.8,69.64
  Bottom 1.651: BSPD_CONN.1 42.76,72.18 BSPD_CONN.2
N$43
  Top 0.406: 57.78,69.65 BSPD_CONN.8
  Top 0.711: F5.1 57.78,69.65
  Bottom 1.651: BSPD_CONN.7 57.76,72.18 BSPD_CONN.8
N$44
  Bottom 0.711: U1.P$1 26.16,64.5 F.1
N$45
  Bottom 0.711: Q10.P$1 58.78,65.28 F6.2
N$46
  Bottom 0.711: U1.P$2 29.34,62.44 R23.2
N$47
  Bottom 0.406: 19.43,62.43 Q1.P$2
  Bottom 0.711: R2.2 19.43,62.43
N$48
  Bottom 0.406: 14.35,62.48 Q2.P$2
  Bottom 0.711: R3.2 14.35,62.48
N$49
  Bottom 0.711: Q10.P$2 60.12,63.88 R22.2
N$50
  Bottom 0.711: R5.2 87.85,50.53 Q5.P$2
N$51
  Bottom 0.711: R19.2 87.85,46.72 Q3.P$2
N$52
  Top 0.406: 52.7,69.62 BSPD_CONN.6
  Top 0.711: F4.1 52.7,69.62
  Bottom 1.651: BSPD_CONN.5 52.76,72.18 BSPD_CONN.6
N$53
  Top 0.406: 47.75,69.67 BSPD_CONN.4
  Top 0.711: F3.1 47.75,69.67
  Bottom 1.651: BSPD_CONN.3 47.76,72.18 BSPD_CONN.4
N$54
  Bottom 0.711: R11.2 65.8,29.14 Q7.P$2
N$55
  Bottom 0.711: F17.1 60.56,34.02 SBRIO_AUX.P$1
N$56
  Bottom 0.711: Q7.P$1 62.23,31.73 F17.2
N$57
  Top 0.711: F18.2 61.99,42.45 Q8.P$1
N$58
  Top 0.406: Q8.P$2 63.05,44.78
  Top 0.711: R12.2 63.12,44.63 Q8.P$2
N$59
  Top 0.711: F18.1 60.55,40.01 SBRIO_AUX.P$6
N$60
  Top 0.711: R15.2 65.66,47.93 U$15.P$2
N$61
  Top 0.711: U$15.P$1 63.12,48.37 R12.1
N$62
  Bottom 0.711: R16.2 61.06,25.89 U$16.P$2
N$63
  Bottom 0.711: R11.1 U$16.P$1
N$64
  Bottom 0.711: R5.1 84.83,51.83 U$17.P$1
N$65
  Bottom 0.711: U$17.P$2 81.49,50.87 R18.2
N$66
  Bottom 0.711: U$18.P$1 86.34,48.01 R19.1
N$67
  Bottom 0.711: U$18.P$2 81.49,47.06 R6.1
N$68
  Bottom 0.711: R20.2 87.85,42.91 Q4.P$2
N$69
  Bottom 0.711: U$19.P$1 86.34,44.2 R20.1
N$70
  Bottom 0.711: U$19.P$2 81.49,43.25 R7.1
N$71
  Bottom 0.711: R21.1 84.83,55.64 U$20.P$1
N$72
  Bottom 0.711: U$20.P$2 81.49,54.68 R10.1
N$73
  Bottom 0.711: R22.1 62.61,63.87 Q9.P$1
N$74
  Bottom 0.711: Q9.P$2 63.63,60.4 R4.2
N$75
  Bottom 0.711: R23.1 29.35,59.56 Q13.P$1
N$76
  Bottom 0.711: Q13.P$2 33.2,60.58 R1.2
N$77
  Bottom 0.711: R2.1 20.83,59.42 U$23.P$1
N$78
  Bottom 0.711: Q11.P$1 14.99,59.04 R3.1
N$79
  Bottom 0.711: R24.2 22.99,57.87 U$23.P$2
N$80
  Bottom 0.711: R25.2 17.91,57.87 Q11.P$2
N$81
  Top 0.711: Q14.P$2 96.98,72.96 R26.2
N$82
  Top 0.711: R28.2 96.08,62.98 Q15.P$2
N$83
  Top 0.711: R30.1 98.89,65.64 WHEEL_SPEED.P$2
N$84
  Top 0.711: R32.2 96.05,69.61 Q17.P$2
SHIELD
  Top 1.016: U$2.P$10 5.84,15.49 5.84,18.03 U$2.P$5
  Bottom 0.406: U$2.P$5 11.3,15.11 11.3,8.92 HV_BOX_CONN.P$2
STEERING_POS
  Top 0.203: 40.08,21.21 40.08,19.94
  Top 0.406: SBRIO_ANALOG.P$21 40.08,19.55 40.08,19.94
  Top 0.635: SBRIO_AUX.P$39 28.17,29.97 32.77,29.97 40.08,22.66 40.08,21.21
  Bottom 0.406: SBRIO_ANALOG.P$21 41.09,4.7 PEDAL_CONN.P$3
THROTTLE_1
  Bottom 0.203: 46.1,17.91 46.1,19.18
  Bottom 0.406: SBRIO_ANALOG.P$18 46.1,19.53 46.1,19.18 | PEDAL_CONN.P$1 46.1,3.68 46.1,17.91
THROTTLE_2
  Bottom 0.203: 44.07,17.91 44.07,19.18
  Bottom 0.406: SBRIO_ANALOG.P$20 44.07,19.56 44.07,19.18 | 44.07,17.91 44.07,3.71 PEDAL_CONN.P$2

### Text on the board
bPlace: Layout By: Kendall Searing | Formula Electric 2014: sbRIO Daughter Card | Design By: Thomas Willson